# Altium project MB1165.PrjPCB (part 1 of 4)
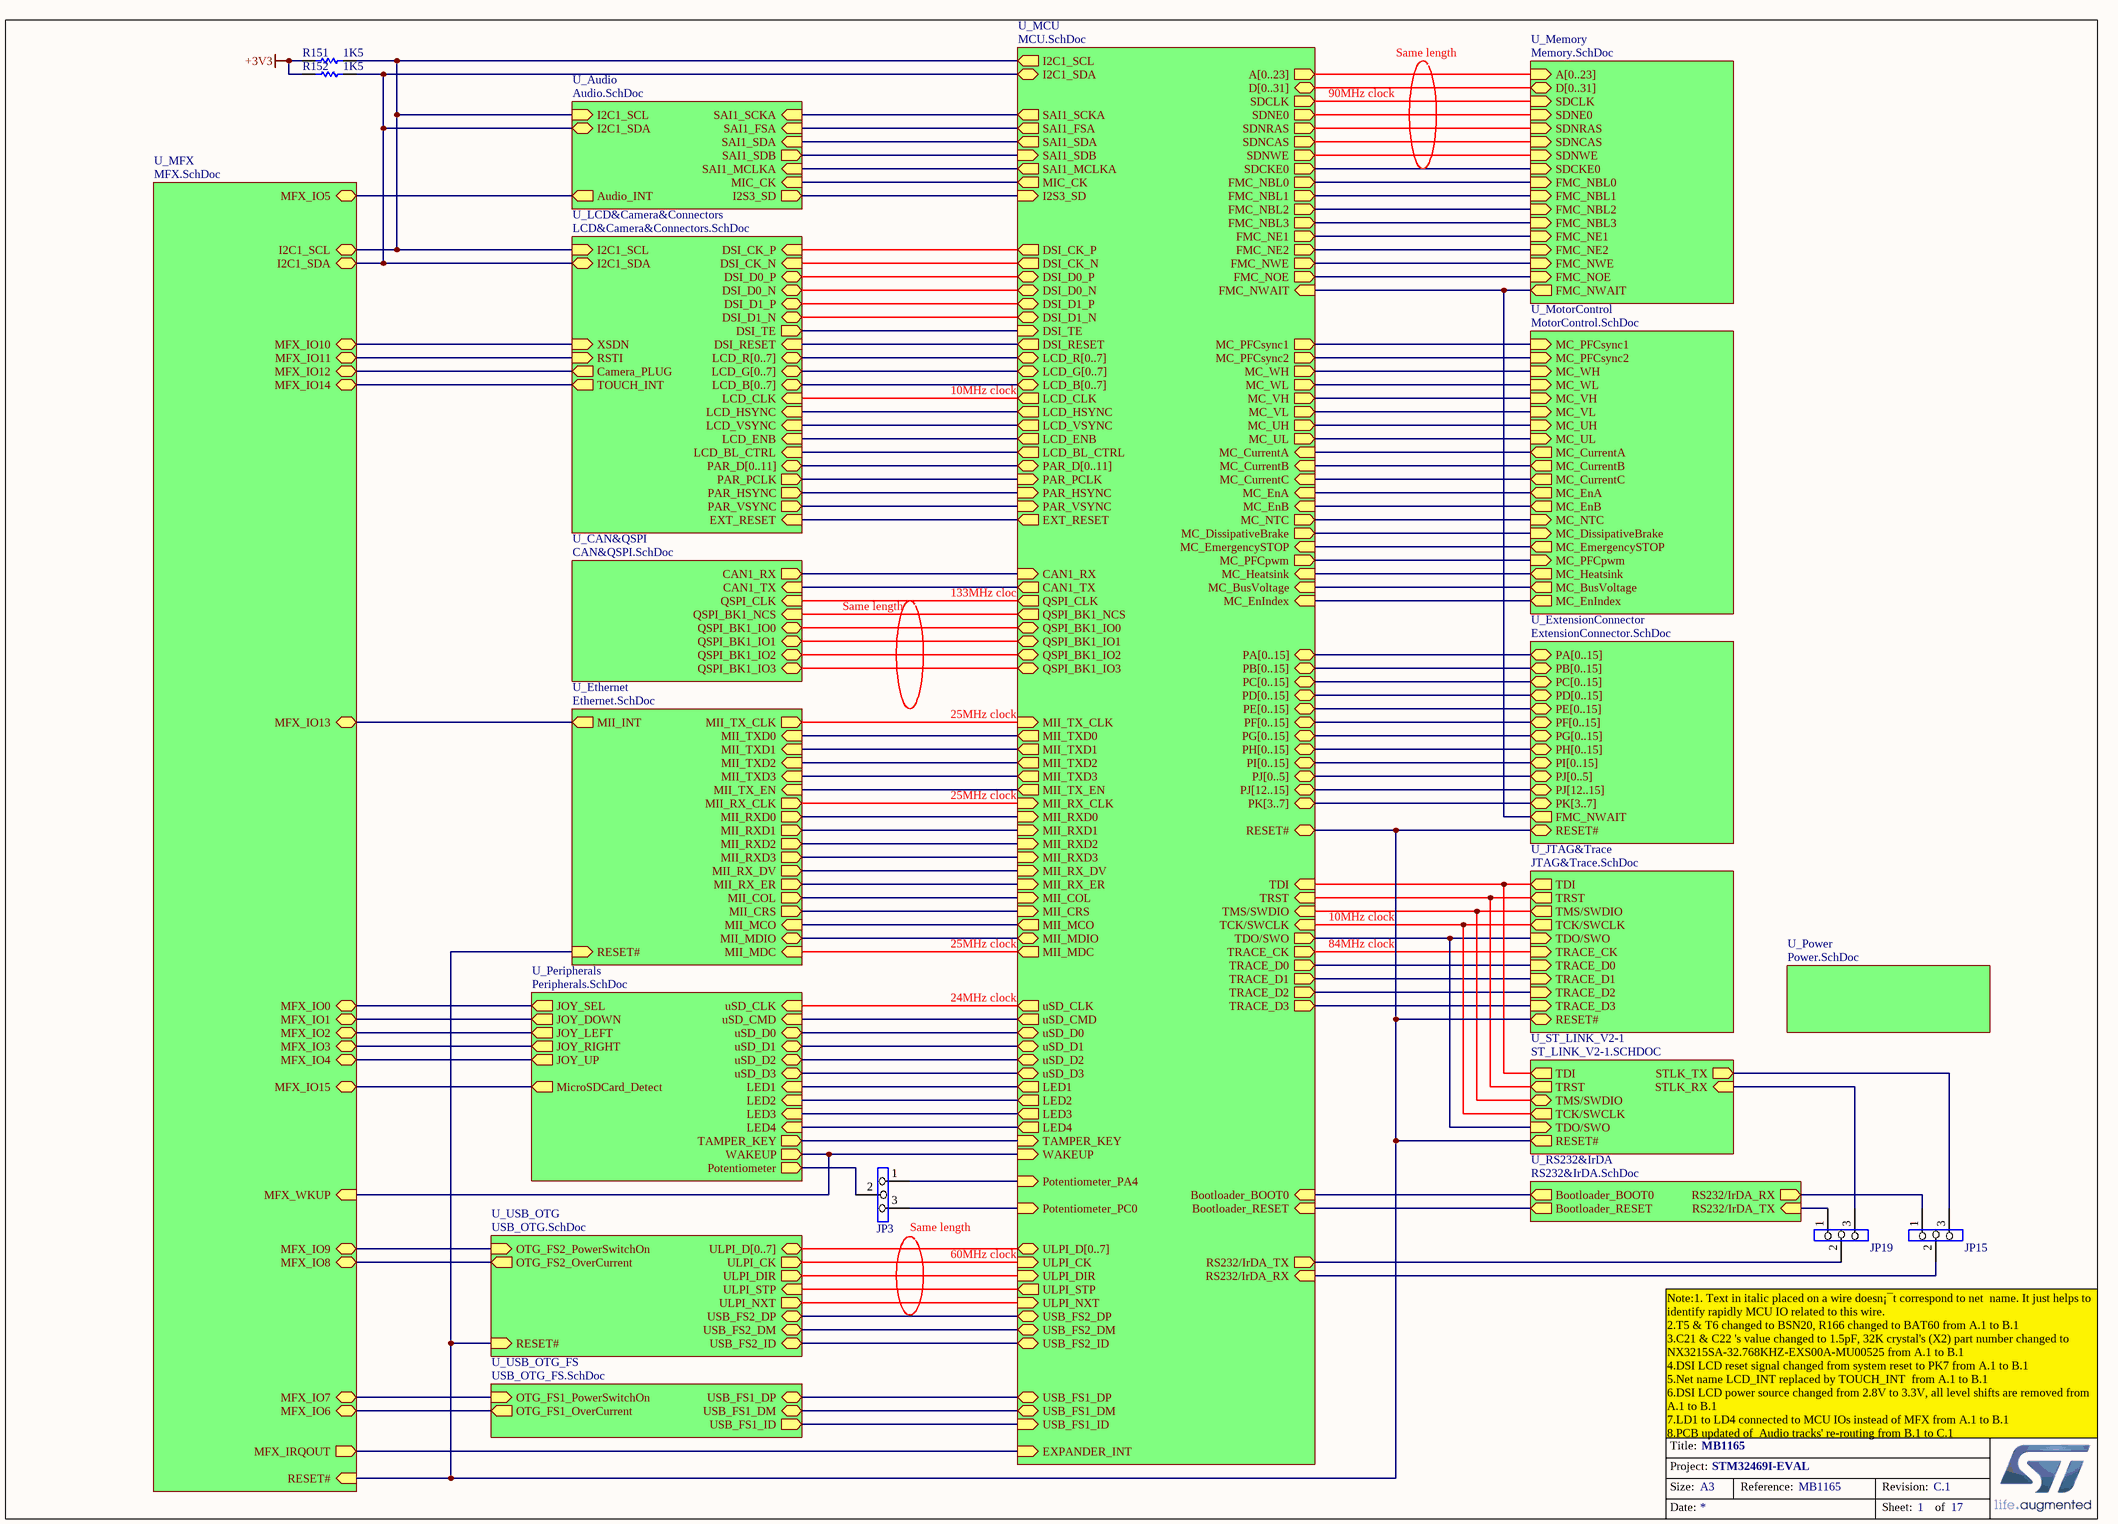
[diagram p0: MB1165.SchDoc]
17 sheets, 707 parts. Net scope: hierarchical (ports join the sheet entries above them; power ports are global).
Sheets:
  MB1165.SchDoc
    U_Audio = Audio.SchDoc
    U_CAN&QSPI = CAN&QSPI.SchDoc
    U_Ethernet = Ethernet.SchDoc
    U_ExtensionConnector = ExtensionConnector.SchDoc
    U_JTAG&Trace = JTAG&Trace.SchDoc
    U_Memory = Memory.SchDoc
    U_MotorControl = MotorControl.SchDoc
    U_Power = Power.SchDoc
    U_RS232&IrDA = RS232&IrDA.SchDoc
    U_ST_LINK_V2-1 = ST_LINK_V2-1.SCHDOC
    U_USB_OTG = USB_OTG.SchDoc
    U_USB_OTG_FS = USB_OTG_FS.SchDoc
    U_MFX = MFX.SchDoc
    U_MCU = MCU.SchDoc
    U_LCD&Camera&Connectors = LCD&Camera&Connectors.SchDoc
    U_Peripherals = Peripherals.SchDoc

## Sheet MB1165.SchDoc: MB1165
size A3; DocumentNumber: MB1165; Revision: C.1; SheetNumber: 1; SheetTotal: 17; Project: STM32469I-EVAL

### Parts
JP3  (no value)  [SIP3]
JP15  (no value)  [SIP3]
JP19  (no value)  [SIP3]
R151  1K5  [0603R]
R152  1K5  [0603R]

### Sub-sheets
U_Audio = Audio.SchDoc: SAI1_SCKA (in), SAI1_FSA (in), SAI1_SDA (in), SAI1_SDB (out), Audio_INT (out), I2C1_SDA (bidir), I2C1_SCL (in), SAI1_MCLKA (in), MIC_CK (in), I2S3_SD (out)
U_CAN&QSPI = CAN&QSPI.SchDoc: CAN1_TX (in), CAN1_RX (out), QSPI_BK1_IO0 (bidir), QSPI_BK1_IO3 (bidir), QSPI_BK1_IO2 (bidir), QSPI_BK1_IO1 (bidir), QSPI_CLK (in), QSPI_BK1_NCS (in)
U_Ethernet = Ethernet.SchDoc: MII_TXD0 (in), MII_TX_EN (in), MII_TX_CLK (out), MII_RXD0 (out), MII_RX_ER (out), MII_RX_DV (out), MII_RX_CLK (out), MII_COL (out), MII_CRS (out), MII_MDC (in), MII_MDIO (bidir), RESET# (in), MII_TXD1 (in), MII_TXD2 (in), MII_TXD3 (in), MII_RXD1 (out), MII_RXD2 (out), MII_RXD3 (out), MII_INT (out), MII_MCO (in)
U_ExtensionConnector = ExtensionConnector.SchDoc: PA[0..15] (bidir), PB[0..15] (bidir), PC[0..15] (bidir), PD[0..15] (bidir), PE[0..15] (bidir), PF[0..15] (bidir), PG[0..15] (bidir), PH[0..15] (bidir), PI[0..15] (bidir), RESET# (bidir), FMC_NWAIT (out), PJ[0..5] (bidir), PK[3..7] (bidir), PJ[12..15] (bidir)
U_JTAG&Trace = JTAG&Trace.SchDoc: TDI (out), RESET# (bidir), TRACE_D3 (in), TRACE_D2 (in), TRACE_D1 (in), TRACE_D0 (in), TRACE_CK (in), TRST (out), TMS/SWDIO (out), TCK/SWCLK (out), TDO/SWO (in)
U_LCD&Camera&Connectors = LCD&Camera&Connectors.SchDoc: LCD_R[0..7] (bidir), LCD_HSYNC (in), LCD_VSYNC (in), LCD_CLK (in), LCD_ENB (in), I2C1_SDA (bidir), I2C1_SCL (in), LCD_B[0..7] (bidir), LCD_G[0..7] (bidir), RSTI (in), XSDN (in), PAR_HSYNC (out), PAR_PCLK (out), PAR_VSYNC (out), PAR_D[0..11] (bidir), TOUCH_INT (out), Camera_PLUG (out), EXT_RESET (in), DSI_CK_P (in), DSI_CK_N (in), DSI_D0_P (bidir), DSI_D0_N (bidir), DSI_D1_P (bidir), DSI_D1_N (bidir), LCD_BL_CTRL (in), DSI_TE (out), DSI_RESET (in)
U_MCU = MCU.SchDoc: PA[0..15] (bidir), PB[0..15] (bidir), PC[0..15] (bidir), PD[0..15] (bidir), PE[0..15] (bidir), PF[0..15] (bidir), PG[0..15] (bidir), PH[0..15] (bidir), PI[0..15] (bidir), MC_EnA (in), MII_RX_CLK (in), MC_EnB (in), MII_MDIO (bidir), MC_EnIndex (in), ULPI_CK (in), MC_EmergencySTOP (in), MII_RX_DV (in), MC_UL (out), LCD_BL_CTRL (out), MC_PFCsync1 (out), RS232/IrDA_TX (out), RS232/IrDA_RX (in), USB_FS1_ID (in), CAN1_RX (in), USB_FS1_DM (bidir), MC_PFCpwm (out), CAN1_TX (out), USB_FS1_DP (bidir), MC_PFCsync2 (out), TMS/SWDIO (in), TCK/SWCLK (in), TDI (in), MC_VL (out), MC_WL (out), TDO/SWO (out), MIC_CK (out), TRST (in), I2C1_SCL (out), MII_TXD3 (out), MC_DissipativeBrake (out), I2C1_SDA (bidir), USB_FS2_ID (bidir), USB_FS2_DM (bidir), USB_FS2_DP (bidir), ULPI_STP (out), MII_MDC (out), MC_CurrentA (in), MII_TXD2 (out), MC_CurrentB (in), MII_TX_CLK (in), MC_CurrentC (in), MII_RXD0 (in), MC_BusVoltage (in), MII_RXD1 (in), MC_Heatsink (in), MC_UH (out), MC_VH (out), uSD_D0 (bidir), MC_WH (out), uSD_D1 (bidir), uSD_D2 (bidir), EXT_RESET (out), uSD_D3 (bidir), uSD_CLK (out), TAMPER_KEY (in), MII_CRS (in), LCD_ENB (out), uSD_CMD (out), FMC_NOE (out), FMC_NWE (out), FMC_NWAIT (in), I2S3_SD (in), FMC_NE1 (out), FMC_NBL3 (out), FMC_NBL2 (out), EXPANDER_INT (in), MII_RX_ER (in), ULPI_DIR (in), LCD_HSYNC (out), LCD_VSYNC (out), LCD_CLK (out), FMC_NBL0 (out), FMC_NBL1 (out), TRACE_CK (out), TRACE_D0 (out), TRACE_D2 (out), TRACE_D1 (out), SAI1_SDA (out), TRACE_D3 (out), SAI1_SDB (in), SAI1_SCKA (out), SAI1_FSA (out), SAI1_MCLKA (out), SDNRAS (out), SDCLK (out), FMC_NE2 (out), MII_TX_EN (out), MC_NTC (out), MII_TXD1 (out), SDNCAS (out), SDCKE0 (out), SDNE0 (out), MII_COL (in), ULPI_NXT (in), SDNWE (out), MII_RXD2 (in), MII_RXD3 (in), LCD_G[0..7] (bidir), LCD_B[0..7] (bidir), D[0..31] (bidir), A[0..23] (out), ULPI_D[0..7] (bidir), RESET# (bidir), PJ[0..5] (bidir), PK[3..7] (bidir), PAR_VSYNC (in), PAR_D[0..11] (bidir), PAR_PCLK (in), PAR_HSYNC (in), MII_MCO (out), LCD_R[0..7] (bidir), Bootloader_BOOT0 (in), QSPI_CLK (out), QSPI_BK1_NCS (out), QSPI_BK1_IO3 (bidir), QSPI_BK1_IO2 (bidir), QSPI_BK1_IO1 (bidir), QSPI_BK1_IO0 (bidir), Bootloader_RESET (in), WAKEUP (in), Potentiometer_PA4 (in), MII_TXD0 (out), Potentiometer_PC0 (in), DSI_TE (in), DSI_CK_P (out), DSI_CK_N (out), DSI_D0_P (bidir), DSI_D0_N (bidir), DSI_D1_P (bidir), DSI_D1_N (bidir), PJ[12..15] (bidir), DSI_RESET (out), LED1 (out), LED2 (out), LED3 (out), LED4 (out)
U_Memory = Memory.SchDoc: FMC_NE1 (in), FMC_NWE (in), FMC_NOE (in), FMC_NWAIT (out), FMC_NBL0 (in), FMC_NBL1 (in), D[0..31] (bidir), A[0..23] (in), SDNCAS (in), SDNWE (in), SDNRAS (in), SDNE0 (in), SDCKE0 (in), SDCLK (in), FMC_NBL3 (in), FMC_NBL2 (in), FMC_NE2 (in)
U_MFX = MFX.SchDoc: MFX_IRQOUT (out), I2C1_SDA (bidir), I2C1_SCL (bidir), MFX_IO5 (bidir), MFX_IO6 (bidir), MFX_IO7 (bidir), MFX_IO8 (bidir), MFX_IO9 (bidir), MFX_IO10 (bidir), MFX_IO11 (bidir), MFX_IO12 (bidir), MFX_IO13 (bidir), MFX_IO14 (bidir), MFX_IO15 (bidir), MFX_WKUP (in), MFX_IO0 (bidir), MFX_IO1 (bidir), MFX_IO2 (bidir), MFX_IO3 (bidir), MFX_IO4 (bidir), RESET# (in)
U_MotorControl = MotorControl.SchDoc: MC_EmergencySTOP (out), MC_CurrentA (out), MC_CurrentB (out), MC_CurrentC (out), MC_PFCsync1 (in), MC_PFCsync2 (in), MC_WL (in), MC_VH (in), MC_VL (in), MC_UH (in), MC_UL (in), MC_WH (in), MC_NTC (in), MC_DissipativeBrake (in), MC_PFCpwm (in), MC_EnA (out), MC_EnB (out), MC_Heatsink (out), MC_BusVoltage (out), MC_EnIndex (out)
U_Peripherals = Peripherals.SchDoc: JOY_SEL (out), JOY_DOWN (out), JOY_LEFT (out), JOY_RIGHT (out), JOY_UP (out), uSD_CLK (in), uSD_CMD (in), uSD_D0 (bidir), uSD_D1 (bidir), uSD_D2 (bidir), uSD_D3 (bidir), MicroSDCard_Detect (out), TAMPER_KEY (out), WAKEUP (out), Potentiometer (out), LED4 (in), LED3 (in), LED1 (in), LED2 (in)
U_Power = Power.SchDoc: no entries
U_RS232&IrDA = RS232&IrDA.SchDoc: RS232/IrDA_TX (in), RS232/IrDA_RX (out), Bootloader_BOOT0 (out), Bootloader_RESET (out)
U_ST_LINK_V2-1 = ST_LINK_V2-1.SCHDOC: STLK_RX (in), STLK_TX (out), TDI (out), TRST (out), TMS/SWDIO (bidir), TCK/SWCLK (out), TDO/SWO (in), RESET# (out)
U_USB_OTG = USB_OTG.SchDoc: ULPI_D[0..7] (bidir), ULPI_CK (out), ULPI_DIR (out), ULPI_NXT (out), ULPI_STP (in), RESET# (in), USB_FS2_DM (bidir), USB_FS2_DP (bidir), OTG_FS2_PowerSwitchOn (in), OTG_FS2_OverCurrent (out), USB_FS2_ID (bidir)
U_USB_OTG_FS = USB_OTG_FS.SchDoc: OTG_FS1_PowerSwitchOn (in), OTG_FS1_OverCurrent (out), USB_FS1_DM (bidir), USB_FS1_DP (bidir), USB_FS1_ID (out)

### Nets
+3V3: R151.1 R152.1
I2C1_SCL: R151.2 ; sheet U_Audio/I2C1_SCL, sheet U_MFX/I2C1_SCL, sheet U_MCU/I2C1_SCL, sheet U_LCD&Camera&Connectors/I2C1_SCL
I2C1_SDA: R152.2 ; sheet U_Audio/I2C1_SDA, sheet U_MFX/I2C1_SDA, sheet U_MCU/I2C1_SDA, sheet U_LCD&Camera&Connectors/I2C1_SDA
LCD_B4: sheet U_MCU/LED1, sheet U_Peripherals/LED1
LCD_B5: sheet U_MCU/LED2, sheet U_Peripherals/LED2
LCD_B6: sheet U_MCU/LED3, sheet U_Peripherals/LED3
LCD_B7: sheet U_MCU/LED4, sheet U_Peripherals/LED4
LCD_BL_CTRL: sheet U_MCU/LCD_BL_CTRL, sheet U_LCD&Camera&Connectors/LCD_BL_CTRL
LCD_R3: sheet U_MCU/DSI_TE, sheet U_LCD&Camera&Connectors/DSI_TE
MII_TXD0: sheet U_Ethernet/MII_TXD0, sheet U_MCU/MII_TXD0
PA4: JP3.1 ; sheet U_MCU/Potentiometer_PA4
PA5: sheet U_USB_OTG/ULPI_CK, sheet U_MCU/ULPI_CK
PA6: sheet U_MotorControl/MC_EmergencySTOP, sheet U_MCU/MC_EmergencySTOP, sheet U_MCU/PAR_PCLK, sheet U_LCD&Camera&Connectors/PAR_PCLK
PA10: JP15.2 ; sheet U_USB_OTG_FS/USB_FS1_ID, sheet U_MCU/RS232/IrDA_RX, sheet U_MCU/USB_FS1_ID
PA11: sheet U_USB_OTG_FS/USB_FS1_DM, sheet U_MCU/USB_FS1_DM
PA13: sheet U_JTAG&Trace/TMS/SWDIO, sheet U_ST_LINK_V2-1/TMS/SWDIO, sheet U_MCU/TMS/SWDIO
PA14: sheet U_JTAG&Trace/TCK/SWCLK, sheet U_ST_LINK_V2-1/TCK/SWCLK, sheet U_MCU/TCK/SWCLK
PA15: sheet U_JTAG&Trace/TDI, sheet U_ST_LINK_V2-1/TDI, sheet U_MCU/TDI
PAR_D1: sheet U_MotorControl/MC_VH, sheet U_MCU/MC_VH
PAR_D8: sheet U_MCU/EXT_RESET, sheet U_LCD&Camera&Connectors/EXT_RESET
PAR_D9: sheet U_MCU/uSD_CLK, sheet U_Peripherals/uSD_CLK
PB4: sheet U_JTAG&Trace/TRST, sheet U_ST_LINK_V2-1/TRST, sheet U_MCU/TRST
PB6: sheet U_CAN&QSPI/QSPI_BK1_NCS, sheet U_MCU/QSPI_BK1_NCS
PB7: sheet U_MCU/PAR_VSYNC, sheet U_LCD&Camera&Connectors/PAR_VSYNC
PC0: JP3.3 ; sheet U_MCU/Potentiometer_PC0
PC13: sheet U_MCU/TAMPER_KEY, sheet U_Peripherals/TAMPER_KEY
PD4: sheet U_Memory/FMC_NOE, sheet U_MCU/FMC_NOE
PD5: sheet U_Memory/FMC_NWE, sheet U_MCU/FMC_NWE
PD7: sheet U_Memory/FMC_NE1, sheet U_MCU/FMC_NE1
PE0: sheet U_Memory/FMC_NBL0, sheet U_MCU/FMC_NBL0
PE1: sheet U_Memory/FMC_NBL1, sheet U_MCU/FMC_NBL1
PF6: sheet U_CAN&QSPI/QSPI_BK1_IO3, sheet U_MCU/QSPI_BK1_IO3
PF7: sheet U_CAN&QSPI/QSPI_BK1_IO2, sheet U_MCU/QSPI_BK1_IO2
PF8: sheet U_CAN&QSPI/QSPI_BK1_IO0, sheet U_MCU/QSPI_BK1_IO0
PF9: sheet U_CAN&QSPI/QSPI_BK1_IO1, sheet U_MCU/QSPI_BK1_IO1
PF10: sheet U_CAN&QSPI/QSPI_CLK, sheet U_MCU/QSPI_CLK
PF11: sheet U_Memory/SDNRAS, sheet U_MCU/SDNRAS
PG7: sheet U_Audio/SAI1_MCLKA, sheet U_MCU/SAI1_MCLKA
PG8: sheet U_Memory/SDCLK, sheet U_MCU/SDCLK
PG9: sheet U_Memory/FMC_NE2, sheet U_MCU/FMC_NE2
PG15: sheet U_Memory/SDNCAS, sheet U_MCU/SDNCAS
PH2: sheet U_Memory/SDCKE0, sheet U_MCU/SDCKE0
PH3: sheet U_Memory/SDNE0, sheet U_MCU/SDNE0
PH5: sheet U_Memory/SDNWE, sheet U_MCU/SDNWE
PH7: sheet U_Ethernet/MII_RXD3, sheet U_MCU/MII_RXD3
PI4: sheet U_Memory/FMC_NBL2, sheet U_MCU/FMC_NBL2
PI5: sheet U_Memory/FMC_NBL3, sheet U_MCU/FMC_NBL3
PI8: sheet U_MFX/MFX_IRQOUT, sheet U_MCU/EXPANDER_INT
PI12: sheet U_MCU/LCD_HSYNC, sheet U_LCD&Camera&Connectors/LCD_HSYNC
PI13: sheet U_MCU/LCD_VSYNC, sheet U_LCD&Camera&Connectors/LCD_VSYNC
PI14: sheet U_MCU/LCD_CLK, sheet U_LCD&Camera&Connectors/LCD_CLK
PK7: sheet U_MCU/LCD_ENB, sheet U_MCU/DSI_RESET, sheet U_LCD&Camera&Connectors/LCD_ENB, sheet U_LCD&Camera&Connectors/DSI_RESET
RESET#: sheet U_Ethernet/RESET#, sheet U_ExtensionConnector/RESET#, sheet U_JTAG&Trace/RESET#, sheet U_ST_LINK_V2-1/RESET#, sheet U_USB_OTG/RESET#, sheet U_MFX/RESET#, sheet U_MCU/RESET#
STLINK_RX: JP19.3 ; sheet U_ST_LINK_V2-1/STLK_RX
STLINK_TX: JP15.3 ; sheet U_ST_LINK_V2-1/STLK_TX
T_JTDO: sheet U_JTAG&Trace/TDO/SWO, sheet U_ST_LINK_V2-1/TDO/SWO, sheet U_MCU/TDO/SWO
TOUCH_INT: sheet U_MFX/MFX_IO14, sheet U_LCD&Camera&Connectors/TOUCH_INT
NetB4_1: sheet U_MFX/MFX_IO2, sheet U_Peripherals/JOY_LEFT
NetB4_2: sheet U_MFX/MFX_IO0, sheet U_Peripherals/JOY_SEL
NetB4_3: sheet U_MFX/MFX_IO1, sheet U_Peripherals/JOY_DOWN
NetB4_4: sheet U_MFX/MFX_IO3, sheet U_Peripherals/JOY_RIGHT
NetB4_6: sheet U_MFX/MFX_IO4, sheet U_Peripherals/JOY_UP
NetC6_2: sheet U_MotorControl/MC_EnA, sheet U_MCU/MC_EnA
NetC7_2: sheet U_MotorControl/MC_PFCsync2, sheet U_MCU/MC_PFCsync2
NetC8_2: sheet U_MotorControl/MC_EnB, sheet U_MCU/MC_EnB
NetC9_2: sheet U_MotorControl/MC_EnIndex, sheet U_MCU/MC_EnIndex
NetC10_2: sheet U_MotorControl/MC_PFCpwm, sheet U_MCU/MC_PFCpwm
NetC11_1: sheet U_MotorControl/MC_Heatsink, sheet U_MCU/MC_Heatsink
NetC12_2: sheet U_MotorControl/MC_CurrentC, sheet U_MCU/MC_CurrentC
NetC13_2: sheet U_MotorControl/MC_CurrentB, sheet U_MCU/MC_CurrentB
NetC14_2: sheet U_MotorControl/MC_CurrentA, sheet U_MCU/MC_CurrentA
NetC15_1: sheet U_MotorControl/MC_BusVoltage, sheet U_MCU/MC_BusVoltage
NetC18_2: sheet U_MotorControl/MC_PFCsync1, sheet U_MCU/MC_PFCsync1
NetCN1_3: sheet U_MotorControl/MC_UH, sheet U_MCU/MC_UH
NetCN1_5: sheet U_MotorControl/MC_UL, sheet U_MCU/MC_UL
NetCN1_9: sheet U_MotorControl/MC_VL, sheet U_MCU/MC_VL
NetCN1_11: sheet U_MotorControl/MC_WH, sheet U_MCU/MC_WH
NetCN1_13: sheet U_MotorControl/MC_WL, sheet U_MCU/MC_WL
NetCN1_21: sheet U_MotorControl/MC_NTC, sheet U_MCU/MC_NTC
NetCN1_23: sheet U_MotorControl/MC_DissipativeBrake, sheet U_MCU/MC_DissipativeBrake
NetCN4_15: sheet U_MFX/MFX_IO12, sheet U_LCD&Camera&Connectors/Camera_PLUG
NetCN4_17: sheet U_MFX/MFX_IO11, sheet U_LCD&Camera&Connectors/RSTI
NetCN4_19: sheet U_MFX/MFX_IO10, sheet U_LCD&Camera&Connectors/XSDN
NetCN4_31: sheet U_MCU/PAR_HSYNC, sheet U_LCD&Camera&Connectors/PAR_HSYNC
NetCN11_6: sheet U_ExtensionConnector/FMC_NWAIT, sheet U_Memory/FMC_NWAIT, sheet U_MCU/FMC_NWAIT
NetCN12_12: sheet U_JTAG&Trace/TRACE_CK, sheet U_MCU/TRACE_CK
NetCN12_14: sheet U_JTAG&Trace/TRACE_D0, sheet U_MCU/TRACE_D0
NetCN12_16: sheet U_JTAG&Trace/TRACE_D1, sheet U_MCU/TRACE_D1
NetCN12_18: sheet U_JTAG&Trace/TRACE_D2, sheet U_MCU/TRACE_D2
NetCN12_20: sheet U_JTAG&Trace/TRACE_D3, sheet U_MCU/TRACE_D3
NetCN14_4: sheet U_USB_OTG/USB_FS2_ID, sheet U_MCU/USB_FS2_ID
NetCN15_3: sheet U_MCU/DSI_CK_P, sheet U_LCD&Camera&Connectors/DSI_CK_P
NetCN15_5: sheet U_MCU/DSI_CK_N, sheet U_LCD&Camera&Connectors/DSI_CK_N
NetCN15_9: sheet U_MCU/DSI_D0_P, sheet U_LCD&Camera&Connectors/DSI_D0_P
NetCN15_11: sheet U_MCU/DSI_D0_N, sheet U_LCD&Camera&Connectors/DSI_D0_N
NetCN15_15: sheet U_MCU/DSI_D1_P, sheet U_LCD&Camera&Connectors/DSI_D1_P
NetCN15_17: sheet U_MCU/DSI_D1_N, sheet U_LCD&Camera&Connectors/DSI_D1_N
NetCN17_1: sheet U_MCU/uSD_D2, sheet U_Peripherals/uSD_D2
NetCN17_2: sheet U_MCU/uSD_D3, sheet U_Peripherals/uSD_D3
NetCN17_3: sheet U_MCU/uSD_CMD, sheet U_Peripherals/uSD_CMD
NetCN17_7: sheet U_MCU/uSD_D0, sheet U_Peripherals/uSD_D0
NetCN17_8: sheet U_MCU/uSD_D1, sheet U_Peripherals/uSD_D1
NetD1_1: sheet U_RS232&IrDA/Bootloader_BOOT0, sheet U_MCU/Bootloader_BOOT0
NetD5_C3: sheet U_USB_OTG_FS/USB_FS1_DP, sheet U_MCU/USB_FS1_DP
NetD6_C3: sheet U_USB_OTG/USB_FS2_DP, sheet U_MCU/USB_FS2_DP
NetD6_D3: sheet U_USB_OTG/USB_FS2_DM, sheet U_MCU/USB_FS2_DM
NetJP3_2: JP3.2 ; sheet U_Peripherals/Potentiometer
NetJP4_2: sheet U_RS232&IrDA/Bootloader_RESET, sheet U_MCU/Bootloader_RESET
NetJP6_3: sheet U_Audio/I2S3_SD, sheet U_MCU/I2S3_SD
NetJP7_3: sheet U_Ethernet/MII_MCO, sheet U_MCU/MII_MCO
NetJP8_2: JP15.1 ; sheet U_RS232&IrDA/RS232/IrDA_RX
NetJP9_2: sheet U_CAN&QSPI/CAN1_RX, sheet U_MCU/CAN1_RX
NetJP18_3: sheet U_Audio/MIC_CK, sheet U_MCU/MIC_CK
NetJP19_1: JP19.1 ; sheet U_RS232&IrDA/RS232/IrDA_TX
NetJP19_2: JP19.2 ; sheet U_MCU/RS232/IrDA_TX
NetR43_2: sheet U_Ethernet/MII_RXD2, sheet U_MCU/MII_RXD2
NetR44_2: sheet U_Ethernet/MII_RXD1, sheet U_MCU/MII_RXD1
NetR45_2: sheet U_Ethernet/MII_RXD0, sheet U_MCU/MII_RXD0
NetR46_2: sheet U_Ethernet/MII_RX_DV, sheet U_MCU/MII_RX_DV
NetR47_2: sheet U_Ethernet/MII_RX_CLK, sheet U_MCU/MII_RX_CLK
NetR57_2: sheet U_Ethernet/MII_TX_CLK, sheet U_MCU/MII_TX_CLK
NetR68_2: sheet U_Ethernet/MII_INT, sheet U_MFX/MFX_IO13
NetR69_1: sheet U_Ethernet/MII_MDIO, sheet U_MCU/MII_MDIO
NetR111_1: sheet U_USB_OTG/OTG_FS2_OverCurrent, sheet U_MFX/MFX_IO8
NetR117_2: sheet U_USB_OTG_FS/OTG_FS1_PowerSwitchOn, sheet U_MFX/MFX_IO7
NetR119_1: sheet U_USB_OTG_FS/OTG_FS1_OverCurrent, sheet U_MFX/MFX_IO6
NetR142_1: sheet U_MFX/MFX_IO15, sheet U_Peripherals/MicroSDCard_Detect
NetR163_2: sheet U_MFX/MFX_WKUP, sheet U_MCU/WAKEUP, sheet U_Peripherals/WAKEUP
NetR233_2: sheet U_Ethernet/MII_TXD2, sheet U_MCU/MII_TXD2
NetR235_2: sheet U_Ethernet/MII_TXD1, sheet U_MCU/MII_TXD1
NetR238_1: sheet U_Ethernet/MII_TXD3, sheet U_MCU/MII_TXD3
NetR242_2: sheet U_Ethernet/MII_TX_EN, sheet U_MCU/MII_TX_EN
NetSB5_1: sheet U_Audio/SAI1_SCKA, sheet U_MCU/SAI1_SCKA
NetSB7_1: sheet U_Audio/SAI1_FSA, sheet U_MCU/SAI1_FSA
NetSB9_1: sheet U_Audio/SAI1_SDB, sheet U_MCU/SAI1_SDB
NetSB12_2: sheet U_Ethernet/MII_RX_ER, sheet U_MCU/MII_RX_ER
NetSB15_1: sheet U_USB_OTG/OTG_FS2_PowerSwitchOn, sheet U_MFX/MFX_IO9
NetSB19_1: sheet U_Audio/SAI1_SDA, sheet U_MCU/SAI1_SDA
NetSB31_2: sheet U_Ethernet/MII_MDC, sheet U_MCU/MII_MDC
NetSB32_2: sheet U_USB_OTG/ULPI_DIR, sheet U_MCU/ULPI_DIR
NetSB34_2: sheet U_USB_OTG/ULPI_STP, sheet U_MCU/ULPI_STP
NetSB48_1: sheet U_Ethernet/MII_CRS, sheet U_MCU/MII_CRS
NetSB56_2: sheet U_USB_OTG/ULPI_NXT, sheet U_MCU/ULPI_NXT
NetSB63_2: sheet U_Ethernet/MII_COL, sheet U_MCU/MII_COL
NetSB67_1: sheet U_CAN&QSPI/CAN1_TX, sheet U_MCU/CAN1_TX
NetU22_15: sheet U_Audio/Audio_INT, sheet U_MFX/MFX_IO5

### Buses and harness runs
bus sheet U_ExtensionConnector/PA[0..15] = sheet U_MCU/PA[0..15]
bus sheet U_ExtensionConnector/PB[0..15] = sheet U_MCU/PB[0..15]
bus sheet U_ExtensionConnector/PC[0..15] = sheet U_MCU/PC[0..15]
bus sheet U_ExtensionConnector/PD[0..15] = sheet U_MCU/PD[0..15]
bus sheet U_ExtensionConnector/PE[0..15] = sheet U_MCU/PE[0..15]
bus sheet U_ExtensionConnector/PF[0..15] = sheet U_MCU/PF[0..15]
bus sheet U_ExtensionConnector/PG[0..15] = sheet U_MCU/PG[0..15]
bus sheet U_ExtensionConnector/PH[0..15] = sheet U_MCU/PH[0..15]
bus sheet U_ExtensionConnector/PI[0..15] = sheet U_MCU/PI[0..15]
bus sheet U_ExtensionConnector/PJ[0..5] = sheet U_MCU/PJ[0..5]
bus sheet U_ExtensionConnector/PJ[12..15] = sheet U_MCU/PJ[12..15]
bus sheet U_ExtensionConnector/PK[3..7] = sheet U_MCU/PK[3..7]
bus sheet U_LCD&Camera&Connectors/LCD_B[0..7] = sheet U_MCU/LCD_B[0..7]
bus sheet U_LCD&Camera&Connectors/LCD_G[0..7] = sheet U_MCU/LCD_G[0..7]
bus sheet U_LCD&Camera&Connectors/LCD_R[0..7] = sheet U_MCU/LCD_R[0..7]
bus sheet U_LCD&Camera&Connectors/PAR_D[0..11] = sheet U_MCU/PAR_D[0..11]
bus sheet U_MCU/A[0..23] = sheet U_Memory/A[0..23]
bus sheet U_MCU/D[0..31] = sheet U_Memory/D[0..31]
bus sheet U_MCU/ULPI_D[0..7] = sheet U_USB_OTG/ULPI_D[0..7]

### Notes on the sheet
- Same length
- 90MHz clock
- 10MHz clock
- 133MHz clock
- 25MHz clock
- 24MHz clock
- 84MHz clock
- (near JP3) Same length
- 60MHz clock
- Note:1. Text in italic placed on a wire doesn¡¯t correspond to net  name. It just helps to identify rapidly MCU IO related to this wire.
  2.T5 & T6 changed to BSN20, R166 changed to BAT60 from A.1 to B.1
  3.C21 & C22 's value changed to 1.5pF, 32K crystal's (X2) part number changed to NX3215SA-32.768KHZ-EXS00A-MU00525 from A.1 to B.1
  4.DSI LCD reset signal changed from system reset to PK7 from A.1 to B.1
  5.Net name LCD_INT replaced by TOUCH_INT  from A.1 to B.1
  6.DSI LCD power source changed from 2.8V to 3.3V, all level shifts are removed from A.1 to B.1
  7.LD1 to LD4 connected to MCU IOs instead of MFX from A.1 to B.1
  8.PCB updated of  Audio tracks' re-routing from B.1 to C.1
- Title:
- Project:
- Size:
- Date:
- A3
- Reference:
- Sheet:
- Revision:
- of

### Library data of the parts
JP3 JP15 JP19 = Jumper3
R151 R152 = Res1: Resistor; Value: 1K; Published: 8-Jun-2000; Revision: July-2002: Re-released for DXP Platform.; Publisher: Altium Limited

## Sheet Audio.SchDoc: Audio
size A4; DocumentNumber: MB1165; Revision: C.1; SheetNumber: 5; SheetTotal: 17; Project: STM32469I-EVAL
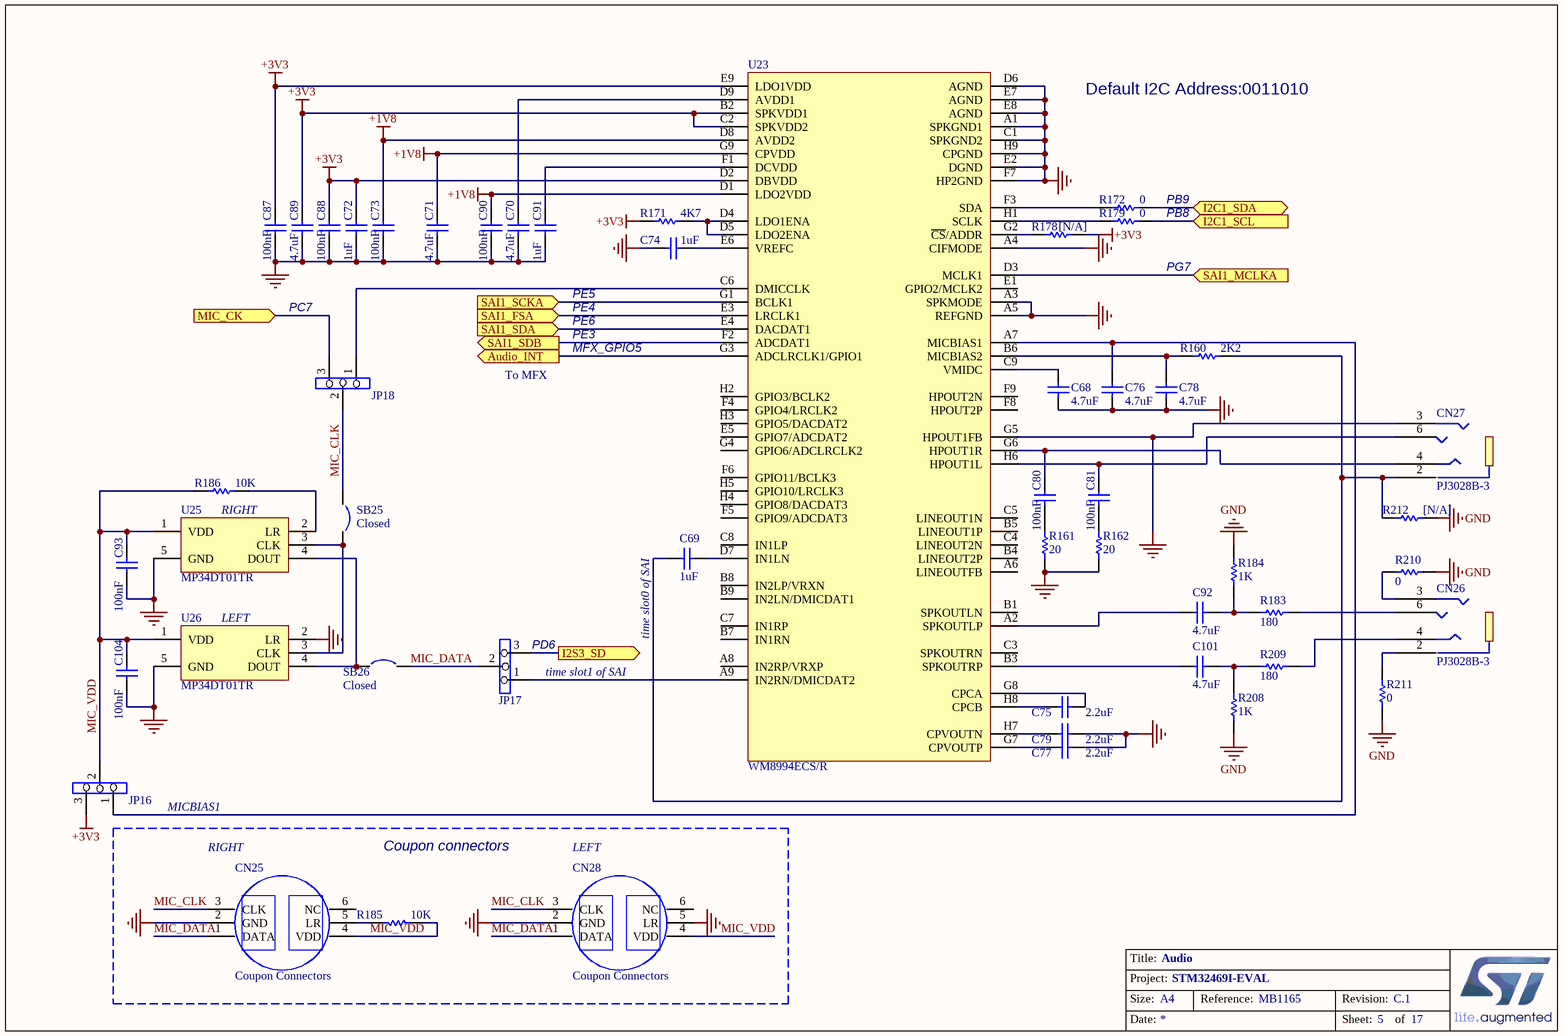
[diagram p1: Audio.SchDoc]

### Parts
C68  4.7uF  [0603C]
C69  1uF  [0603C]
C70  4.7uF  [0603C]
C71  4.7uF  [0603C]
C72  1uF  [0603C]
C73  100nF  [0603C]
C74  1uF  [0603C]
C75  2.2uF  [0603C]
C76  4.7uF  [0603C]
C77  2.2uF  [0603C]
C78  4.7uF  [0603C]
C79  2.2uF  [0603C]
C80  100nF  [0603C]
C81  100nF  [0603C]
C87  100nF  [0603C]
C88  100nF  [0603C]
C89  4.7uF  [0603C]
C90  100nF  [0603C]
C91  1uF  [0603C]
C92  4.7uF  [0603C]
C93  100nF  [0603C]
C101  4.7uF  [0603C]
C104  100nF  [0603C]
CN25  Coupon Connectors  [Coupon]
CN26  PJ3028B-3  [PJ3028B]
CN27  PJ3028B-3  [PJ3028B]
CN28  Coupon Connectors  [Coupon]
JP16  (no value)  [SIP3]
JP17  (no value)  [SIP3]
JP18  (no value)  [SIP3]
R160  2K2  [0603R]
R161  20  [0603R]
R162  20  [0603R]
R171  4K7  [0603R]
R172  0  [0603R]
R178  [N/A]  [0603R]
R179  0  [0603R]
R183  180  [0402R]
R184  1K  [0402R]
R185  10K  [0603R]
R186  10K  [0603R]
R208  1K  [0402R]
R209  180  [0402R]
R210  0  [0603R]
R211  0  [0603R]
R212  [N/A]  [0603R]
SB25  Closed  [SB_0603]
SB26  Closed  [SB_0603]
U23  WM8994ECS/R  [BGA72_0R5_4R5X4]
U25  MP34DT01TR  [MP34DT01TR]
U26  MP34DT01TR  [MP34DT01TR]

### Blocks framed on the sheet
Coupon connectors: CN25 CN28 R185

### Ports
Audio_INT (out), I2C1_SCL (in), I2C1_SDA (bidir), I2S3_SD (out), MIC_CK (in), SAI1_FSA (in), SAI1_MCLKA (in), SAI1_SCKA (in), SAI1_SDA (in), SAI1_SDB (out)

### Nets
+1V8: C71.1 C73.1 C90.1 U23.D1(LDO2VDD) U23.D8(AVDD2) U23.G9(CPVDD)
+3V3: C72.1 C87.1 C88.1 C89.1 JP16.3 R171.2 R178.1 U23.B2(SPKVDD1) U23.C2(SPKVDD2) U23.D2(DBVDD) U23.E9(LDO1VDD)
GND: C68.1 C70.2 C71.2 C72.2 C73.2 C74.2 C76.1 C77.2 C78.1 C79.2 C87.2 C88.2 C89.2 C90.2 C91.2 C93.2 C104.2 CN25.2(GND) CN27.3 CN28.2(GND) CN28.5(LR) R161.2 R162.2 R184.2 R208.1 R210.2 R211.2 R212.1 U23.A1(SPKGND1) U23.A3(SPKMODE) U23.A4(CIFMODE) U23.A5(REFGND) U23.C1(SPKGND2) U23.D6(AGND) U23.E2(DGND) U23.E7(AGND) U23.E8(AGND) U23.F7(HP2GND) U23.G5(HPOUT1FB) U23.H9(CPGND) U25.5(GND) U26.2(LR) U26.5(GND)
I2C1_SCL: R179.1 ; port I2C1_SCL
I2C1_SDA: R172.1 ; port I2C1_SDA
MIC_CLK: CN25.3(CLK) CN28.3(CLK) JP18.2 SB25.1
MIC_DATA: CN25.1(DATA) CN28.1(DATA) JP17.2 SB26.2
MIC_VDD: C93.1 C104.1 CN25.4(VDD) CN28.4(VDD) JP16.2 R185.2 R186.2 U25.1(VDD) U26.1(VDD)
PG7: U23.D3(MCLK1) ; port SAI1_MCLKA
NetC68_2: C68.2 U23.C9(VMIDC)
NetC69_1: C69.1 U23.D7(IN1LN)
NetC69_2: C69.2 CN27.2 R160.1 R212.2
NetC70_1: C70.1 U23.D9(AVDD1)
NetC74_1: C74.1 U23.E6(VREFC)
NetC75_1: C75.1 U23.H8(CPCB)
NetC75_2: C75.2 U23.G8(CPCA)
NetC76_2: C76.2 JP16.1 U23.A7(MICBIAS1)
NetC77_1: C77.1 U23.G7(CPVOUTP)
NetC78_2: C78.2 R160.2 U23.B6(MICBIAS2)
NetC79_1: C79.1 U23.H7(CPVOUTN)
NetC80_1: C80.1 CN27.4 U23.G6(HPOUT1R)
NetC80_2: C80.2 R161.1
NetC81_1: C81.1 CN27.6 U23.H6(HPOUT1L)
NetC81_2: C81.2 R162.1
NetC91_1: C91.1 U23.F1(DCVDD)
NetC92_1: C92.1 R183.1 R184.1
NetC92_2: C92.2 U23.A2(SPKOUTLP)
NetC101_1: C101.1 R208.2 R209.2
NetC101_2: C101.2 U23.B3(SPKOUTRP)
NetCN25_5: CN25.5(LR) R185.1
NetCN26_2: CN26.2 R211.1
NetCN26_3: CN26.3 R210.1
NetCN26_4: CN26.4 R209.1
NetCN26_6: CN26.6 R183.2
NetJP6_3: JP17.3 ; port I2S3_SD
NetJP17_1: JP17.1 U23.A9(IN2RN/DMICDAT2)
NetJP18_1: JP18.1 U23.C6(DMICCLK)
NetJP18_3: JP18.3 ; port MIC_CK
NetR171_1: R171.1 U23.D4(LDO1ENA) U23.D5(LDO2ENA)
NetR172_2: R172.2 U23.F3(SDA)
NetR178_2: R178.2 U23.G2(~{CS}/ADDR)
NetR179_2: R179.2 U23.H1(SCLK)
NetR186_1: R186.1 U25.2(LR)
NetSB5_1: U23.G1(BCLK1) ; port SAI1_SCKA
NetSB7_1: U23.E3(LRCLK1) ; port SAI1_FSA
NetSB9_1: U23.F2(ADCDAT1) ; port SAI1_SDB
NetSB19_1: U23.E4(DACDAT1) ; port SAI1_SDA
NetSB25_2: SB25.2 U25.3(CLK) U26.3(CLK)
NetSB26_1: SB26.1 U25.4(DOUT) U26.4(DOUT)
NetU22_15: U23.G3(ADCLRCLK1/GPIO1) ; port Audio_INT

Not connected (* = marked no-connect by the designer): CN25 6(NC); CN28 6(NC); U23 A6(LINEOUTFB) A8(IN2RP/VRXP) B1(SPKOUTLN) B4(LINEOUT2P) B5(LINEOUT1P) B7(IN1RN) B8(IN2LP/VRXN) B9(IN2LN/DMICDAT1) C3(SPKOUTRN) C4(LINEOUT2N) C5(LINEOUT1N) C7(IN1RP) C8(IN1LP) E1(GPIO2/MCLK2) E5(GPIO7/ADCDAT2) F4(GPIO4/LRCLK2) F5(GPIO9/ADCDAT3) F6(GPIO11/BCLK3) F8(HPOUT2P) F9(HPOUT2N) G4(GPIO6/ADCLRCLK2) H2(GPIO3/BCLK2) H3(GPIO5/DACDAT2) H4(GPIO8/DACDAT3) H5(GPIO10/LRCLK3)

### Notes on the sheet
- Default I2C Address:0011010
- PB9
- PB8
- PC7
- PE5
- PE4
- PG7
- To MFX
- PE6
- PE3
- MFX_GPIO5
- RIGHT
- (near U26) LEFT
- (near JP17) PD6
- (near C69) time slot0 of SAI
- (near JP17) time slot1 of SAI
- MICBIAS1
- LEFT
- Title:
- Project:
- Size:
- Date:
- A4
- Reference:
- Sheet:
- Revision:
- of

### Library data of the parts
C68 C70 C71 C73 C76 C78 C80 C81 C87-C90 C93 C104 = Cap: Capacitor; Value: 10nF; Published: 8-Jun-2000; Revision: July-2002: Re-released for DXP Platform.; Publisher: Altium Limited
C69 C72 C74 C75 C77 C79 C91 = CAP: Capacitor; Value: 100nF; Published: 8-Jun-2000; Revision: July-2002: Re-released for DXP Platform.; Publisher: Altium Limited
C92 C101 = Cap: Capacitor; Value: 10nF; Ordered by: Subcon; Published: 8-Jun-2000; Revision: July-2002: Re-released for DXP Platform.; Publisher: Altium Limited
CN25 CN28 = Coupon Connectors: Header, 3-Pin, Single row; Revision: 17-Jul-2002: Re-released for DXP Platform.; Publisher: Altium Limited
JP16-JP18 = Jumper3
R160-R162 R171 R172 R178 R179 R185 R186 R212 = Res1: Resistor; Value: 1K; Published: 8-Jun-2000; Revision: July-2002: Re-released for DXP Platform.; Publisher: Altium Limited
R183 R209-R211 = Res1: Resistor; Value: 1K; Ordered by: Subcon; Published: 8-Jun-2000; Revision: July-2002: Re-released for DXP Platform.; Publisher: Altium Limited
R184 R208 = Res1: Resistor; Ordered by: Subcon; Published: 8-Jun-2000; Revision: July-2002: Re-released for DXP Platform.; Publisher: Altium Limited; Value: 1K
SB25 SB26 = Circuit Breaker_close: Circuit Breaker; Published: 24-Mar-1999; Revision: July-2002: Re-released for DXP Platform.; Publisher: Altium Limited
U25 U26 = MP34DT01TR: MEMS audio sensor; Revision: 17-Jul-2002: Re-released for DXP Platform.; Publisher: Altium Limited

## Sheet CAN&QSPI.SchDoc: CAN & QSPI
size A4; DocumentNumber: MB1165; Revision: C.1; SheetNumber: 11; SheetTotal: 17; Project: STM32469I-EVAL
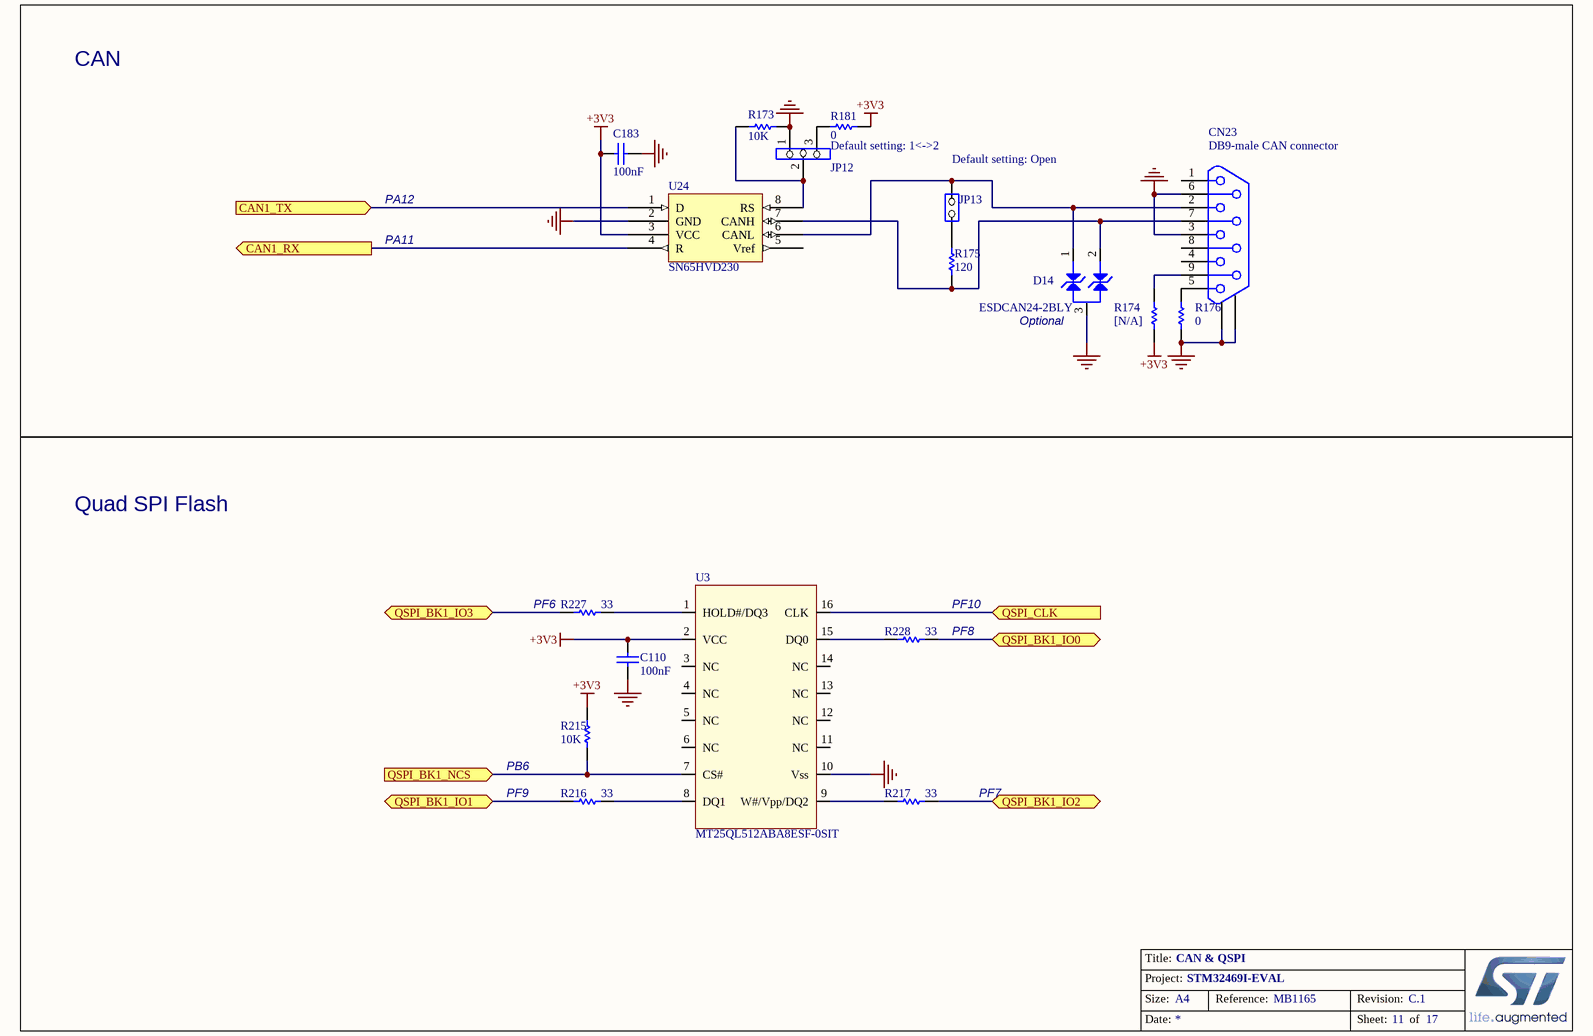
[diagram p2: CAN&QSPI.SchDoc]

### Parts
C110  100nF  [0402C]
C183  100nF  [0603C]
CN23  DB9-male CAN connector  [DB9/M]
D14  ESDCAN24-2BLY  [SOT-23]
JP12  (no value)  [SIP3]
JP13  (no value)  [SIP2]
R173  10K  [0603R]
R174  [N/A]  [0603R]
R175  120  [0603R]
R176  0  [0603R]
R181  0  [0603R]
R215  10K  [0402R]
R216  33  [0603R]
R217  33  [0603R]
R227  33  [0603R]
R228  33  [0603R]
U3  MT25QL512ABA8ESF-0SIT  [SOIC16W_1R27_10R3X10R33]
U24  SN65HVD230  [SOIC8_1R27_4R9X6]

### Ports
CAN1_RX (out), CAN1_TX (in), QSPI_BK1_IO0 (bidir), QSPI_BK1_IO1 (bidir), QSPI_BK1_IO2 (bidir), QSPI_BK1_IO3 (bidir), QSPI_BK1_NCS (in), QSPI_CLK (in)

### Nets
+3V3: C110.1 C183.1 R174.1 R181.2 R215.1 U3.2(VCC) U24.3(VCC)
GND: C110.2 C183.2 CN23.3 CN23.6 CN23.10 CN23.11 D14.3 JP12.1 R173.2 R176.1 U3.10(Vss) U24.2(GND)
PB6: R215.2 U3.7(CS#) ; port QSPI_BK1_NCS
PF6: R227.2 ; port QSPI_BK1_IO3
PF7: R217.1 ; port QSPI_BK1_IO2
PF8: R228.1 ; port QSPI_BK1_IO0
PF9: R216.2 ; port QSPI_BK1_IO1
PF10: U3.16(CLK) ; port QSPI_CLK
NetCN23_2: CN23.2 D14.1 JP13.2(NO) U24.6(CANL)
NetCN23_5: CN23.5 R176.2
NetCN23_7: CN23.7 D14.2 R175.1 U24.7(CANH)
NetCN23_9: CN23.9 R174.2
NetJP9_2: U24.4(R) ; port CAN1_RX
NetJP12_2: JP12.2 R173.1 U24.8(RS)
NetJP12_3: JP12.3 R181.1
NetJP13_1: JP13.1(COMMON) R175.2
NetR216_1: R216.1 U3.8(DQ1)
NetR217_2: R217.2 U3.9(W#/Vpp/DQ2)
NetR227_1: R227.1 U3.1(HOLD#/DQ3)
NetR228_2: R228.2 U3.15(DQ0)
NetSB67_1: U24.1(D) ; port CAN1_TX

Not connected (* = marked no-connect by the designer): CN23 1 4 8; U3 3(NC) 4(NC) 5(NC) 6(NC) 11(NC) 12(NC) 13(NC) 14(NC); U24 5(Vref)

### Notes on the sheet
- CAN
- Default setting: 1<->2
- (near JP13) Default setting: Open
- PA12
- PA11
- (near D14) Optional
- Quad SPI Flash
- (near R227) PF6
- (near R228) PF8
- (near R228) PF10
- PB6
- PF9
- (near R217) PF7
- Title:
- Project:
- Size:
- Date:
- A4
- Reference:
- Sheet:
- Revision:
- of

### Library data of the parts
C110 = Cap: as C92 on sheet Audio; Published: 8-Jun-2000; Revision: July-2002: Re-released for DXP Platform.; Publisher: Altium Limited
C183 = Cap: Capacitor; Value: 10nF; Published: 8-Jun-2000; Revision: July-2002: Re-released for DXP Platform.; Publisher: Altium Limited
CN23 = DB9-CAN
JP12 = Jumper3
JP13 = JP2
R173 R216 R217 R227 R228 = Res1: Resistor; Value: 1K; Published: 8-Jun-2000; Revision: July-2002: Re-released for DXP Platform.; Publisher: Altium Limited
R174-R176 R181 = res1: Resistor; Value: 1K; Published: 8-Jun-2000; Revision: July-2002: Re-released for DXP Platform.; Publisher: Altium Limited
R215 = res1: Resistor; Value: 1K; Ordered by: Subcon; Published: 8-Jun-2000; Revision: July-2002: Re-released for DXP Platform.; Publisher: Altium Limited
U3 = QSPI_16pins: ECCN_US/EU: 3A991
U24 = SN65HVD230D

## Sheet Ethernet.SchDoc: Ethernet
size A4; DocumentNumber: MB1165; Revision: C.1; SheetNumber: 7; SheetTotal: 17; Project: STM32469I-EVAL
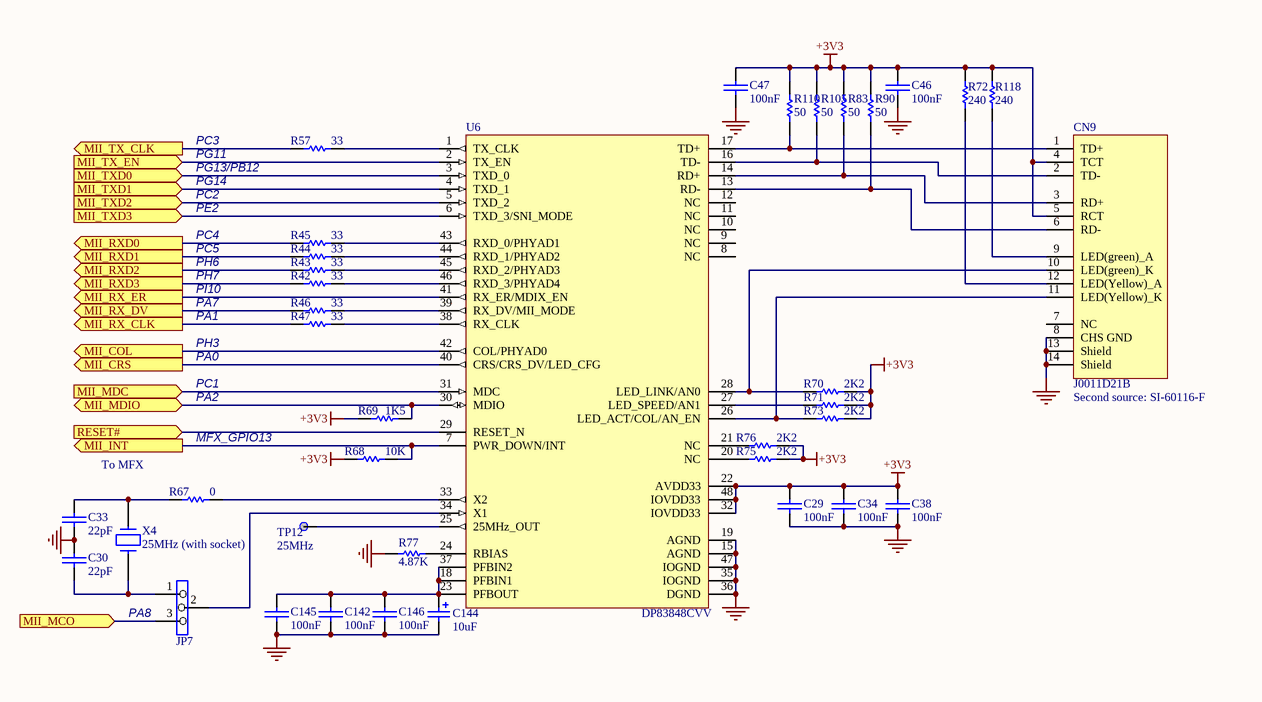
[diagram p3: Ethernet.SchDoc]

### Parts
C29  100nF  [0603C]
C30  22pF  [0603C]
C33  22pF  [0603C]
C34  100nF  [0603C]
C38  100nF  [0603C]
C46  100nF  [0603C]
C47  100nF  [0603C]
C142  100nF  [0603C]
C144  10uF  [TAN-A]
C145  100nF  [0603C]
C146  100nF  [0603C]
CN9  J0011D21B  [RJ45_J0011D01BNL]
JP7  (no value)  [SIP3]
R42  33  [0603R]
R43  33  [0603R]
R44  33  [0603R]
R45  33  [0603R]
R46  33  [0603R]
R47  33  [0603R]
R57  33  [0603R]
R67  0  [0603R]
R68  10K  [0603R]
R69  1K5  [0603R]
R70  2K2  [0603R]
R71  2K2  [0603R]
R72  240  [0603R]
R73  2K2  [0603R]
R75  2K2  [0603R]
R76  2K2  [0603R]
R77  4.87K  [0603R]
R83  50  [0603R]
R90  50  [0603R]
R105  50  [0603R]
R110  50  [0603R]
R118  240  [0603R]
TP12  25MHz  [TP]
U6  DP83848CVV  [LQFP48_0R5_9X9]
X4  25MHz (with socket)  [XTAL_socket]

### Ports
MII_COL (out), MII_CRS (out), MII_INT (out), MII_MCO (in), MII_MDC (in), MII_MDIO (bidir), MII_RX_CLK (out), MII_RX_DV (out), MII_RX_ER (out), MII_RXD0 (out), MII_RXD1 (out), MII_RXD2 (out), MII_RXD3 (out), MII_TX_CLK (out), MII_TX_EN (in), MII_TXD0 (in), MII_TXD1 (in), MII_TXD2 (in), MII_TXD3 (in), RESET# (in)

### Nets
+3V3: C29.1 C34.2 C38.2 C46.2 C47.2 CN9.4(TCT) CN9.5(RCT) R68.1 R69.2 R70.2 R71.2 R72.2 R73.2 R75.2 R76.2 R83.1 R90.1 R105.1 R110.1 R118.2 U6.22(AVDD33) U6.32(IOVDD33) U6.48(IOVDD33)
GND: C29.2 C30.2 C33.1 C34.1 C38.1 C46.1 C47.1 C142.1 C144.2 C145.2 C146.1 CN9.8(CHS_GND) CN9.13(Shield) CN9.14(Shield) R77.1 U6.15(AGND) U6.19(AGND) U6.35(IOGND) U6.36(DGND) U6.47(IOGND)
MII_TXD0: U6.3(TXD_0) ; port MII_TXD0
PH7: R42.2 ; port MII_RXD3
RESET#: U6.29(RESET_N) ; port RESET#
NetC30_1: C30.1 JP7.1 X4.1
NetC33_2: C33.2 R67.2 X4.2
NetC142_2: C142.2 C144.1 C145.1 C146.2 U6.18(PFBIN1) U6.23(PFBOUT) U6.37(PFBIN2)
NetCN9_1: CN9.1(TD+) R110.2 U6.17(TD+)
NetCN9_2: CN9.2(TD-) R105.2 U6.16(TD-)
NetCN9_3: CN9.3(RD+) R83.2 U6.14(RD+)
NetCN9_6: CN9.6(RD-) R90.2 U6.13(RD-)
NetCN9_9: CN9.9(LED(green)_A) R118.1
NetCN9_10: CN9.10(LED(green)_K) R70.1 U6.28(LED_LINK/AN0)
NetCN9_11: CN9.11(LED(Yellow)_K) R73.1 U6.26(LED_ACT/COL/AN_EN)
NetCN9_12: CN9.12(LED(Yellow)_A) R72.1
NetJP7_2: JP7.2 U6.34(X1)
NetJP7_3: JP7.3 ; port MII_MCO
NetR42_1: R42.1 U6.46(RXD_3/PHYAD4)
NetR43_1: R43.1 U6.45(RXD_2/PHYAD3)
NetR43_2: R43.2 ; port MII_RXD2
NetR44_1: R44.1 U6.44(RXD_1/PHYAD2)
NetR44_2: R44.2 ; port MII_RXD1
NetR45_1: R45.1 U6.43(RXD_0/PHYAD1)
NetR45_2: R45.2 ; port MII_RXD0
NetR46_1: R46.1 U6.39(RX_DV/MII_MODE)
NetR46_2: R46.2 ; port MII_RX_DV
NetR47_1: R47.1 U6.38(RX_CLK)
NetR47_2: R47.2 ; port MII_RX_CLK
NetR57_1: R57.1 U6.1(TX_CLK)
NetR57_2: R57.2 ; port MII_TX_CLK
NetR67_1: R67.1 U6.33(X2)
NetR68_2: R68.2 U6.7(PWR_DOWN/INT) ; port MII_INT
NetR69_1: R69.1 U6.30(MDIO) ; port MII_MDIO
NetR71_1: R71.1 U6.27(LED_SPEED/AN1)
NetR75_1: R75.1 U6.20(NC)
NetR76_1: R76.1 U6.21(NC)
NetR77_2: R77.2 U6.24(RBIAS)
NetR233_2: U6.5(TXD_2) ; port MII_TXD2
NetR235_2: U6.4(TXD_1) ; port MII_TXD1
NetR238_1: U6.6(TXD_3/SNI_MODE) ; port MII_TXD3
NetR242_2: U6.2(TX_EN) ; port MII_TX_EN
NetSB12_2: U6.41(RX_ER/MDIX_EN) ; port MII_RX_ER
NetSB31_2: U6.31(MDC) ; port MII_MDC
NetSB48_1: U6.40(CRS/CRS_DV/LED_CFG) ; port MII_CRS
NetSB63_2: U6.42(COL/PHYAD0) ; port MII_COL
NetTP12_1: TP12.1 U6.25(25MHz_OUT)

Not connected (* = marked no-connect by the designer): CN9 7(NC); U6 8(NC) 9(NC) 10(NC) 11(NC) 12(NC)

### Notes on the sheet
- PC3
- PG11
- PG13/PB12
- PG14
- PC2
- PE2
- PC4
- PC5
- PH6
- PH7
- PI10
- PA7
- PH3
- PA1
- PA0
- PC1
- PA2
- (near CN9) Second source: SI-60116-F
- To MFX
- MFX_GPIO13
- (near JP7) PA8
- Title:
- Project:
- Size:
- Date:
- A4
- Reference:
- Sheet:
- Revision:
- of

### Library data of the parts
C29 C30 C33 C34 C38 C46 C47 C142 C145 C146 = CAP: Capacitor
C144 = Cap Pol1: Polarized Capacitor (Radial); Published: 8-Jun-2000; Revision: July-2002: Re-released for DXP Platform.; Publisher: Altium Limited; Value: 10uF
JP7 = Jumper3
R42-R47 R57 R67-R73 R75-R77 R83 R90 R105 R110 R118 = Res1: Resistor; Value: 1K; Published: 8-Jun-2000; Revision: July-2002: Re-released for DXP Platform.; Publisher: Altium Limited
TP12 = TP
X4 = CRYSTAL

## Sheet ExtensionConnector.SchDoc: Extension Connectors
size A4; DocumentNumber: MB1165; Revision: C.1; SheetNumber: 14; SheetTotal: 17; Project: STM32469I-EVAL
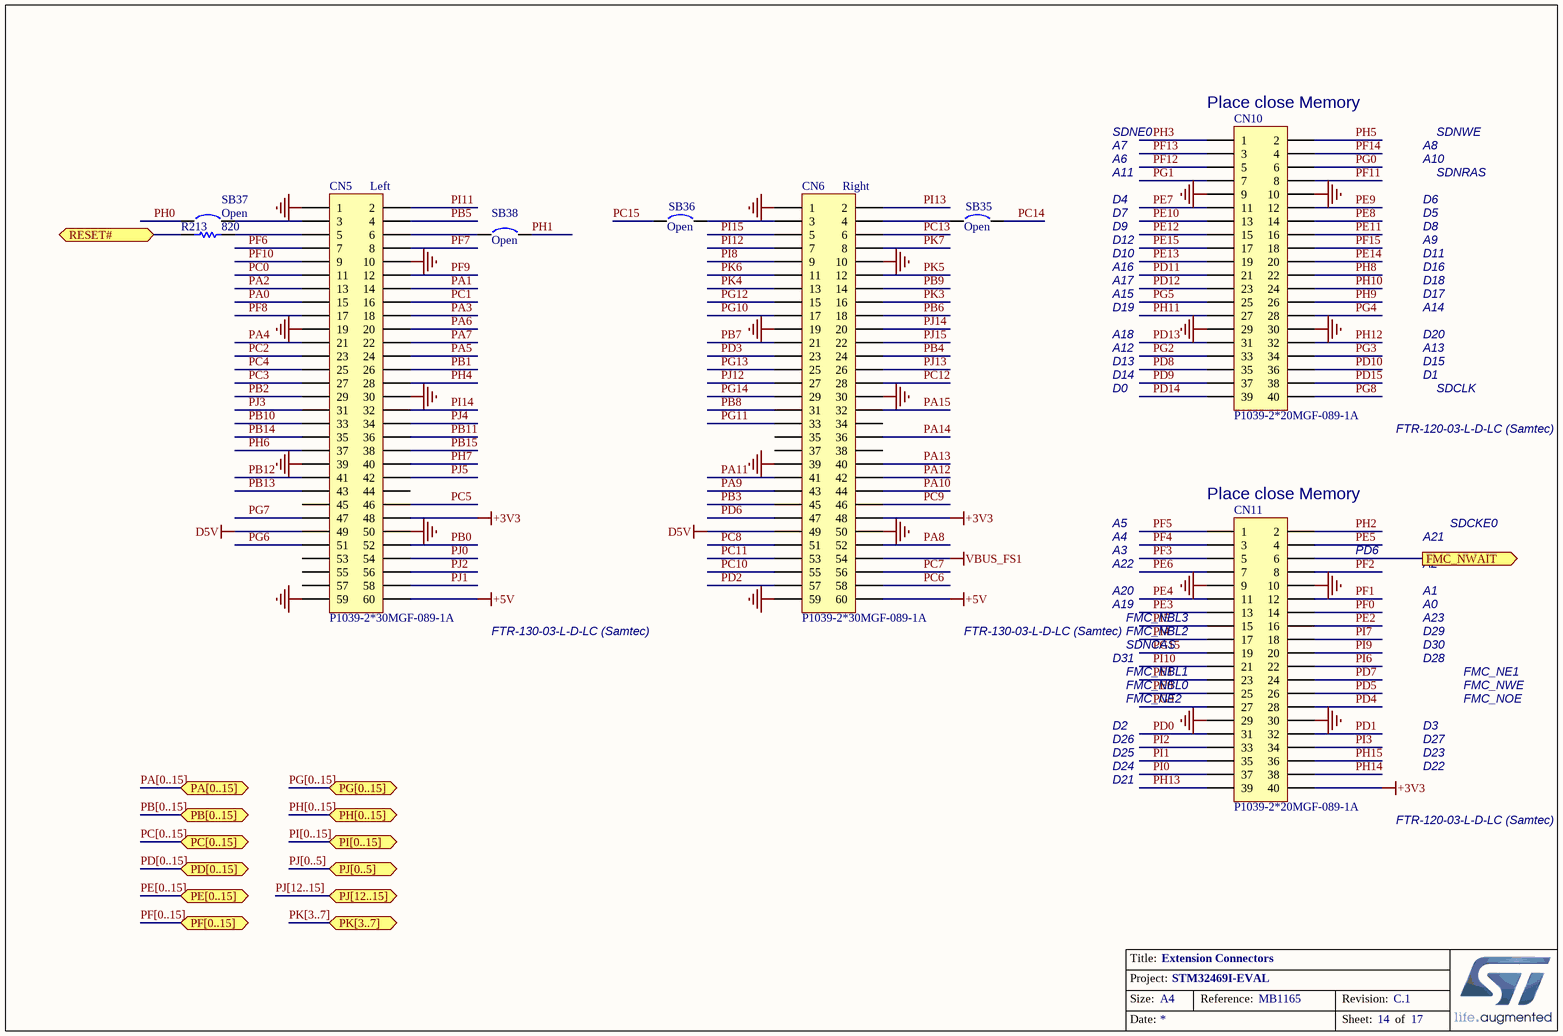
[diagram p4: ExtensionConnector.SchDoc]

### Parts
CN5  P1039-2*30MGF-089-1A  [FTR-130-53-L-D-LC]
CN6  P1039-2*30MGF-089-1A  [FTR-130-53-L-D-LC]
CN10  P1039-2*20MGF-089-1A  [FTR-120-53-L-D-LC]
CN11  P1039-2*20MGF-089-1A  [FTR-120-53-L-D-LC]
R213  820  [0603R]
SB35  Open  [SB_0603]
SB36  Open  [SB_0603]
SB37  Open  [SB_0603]
SB38  Open  [SB_0603]

### Ports
FMC_NWAIT (out), PA[0..15] (bidir), PB[0..15] (bidir), PC[0..15] (bidir), PD[0..15] (bidir), PE[0..15] (bidir), PF[0..15] (bidir), PG[0..15] (bidir), PH[0..15] (bidir), PI[0..15] (bidir), PJ[0..5] (bidir), PJ[12..15] (bidir), PK[3..7] (bidir), RESET# (bidir)

### Nets
+3V3: CN5.48 CN6.48 CN11.40
+5V: CN5.60 CN6.60
D5V: CN5.49 CN6.49
GND: CN5.1 CN5.10 CN5.19 CN5.30 CN5.39 CN5.50 CN5.59 CN6.1 CN6.10 CN6.19 CN6.30 CN6.39 CN6.50 CN6.59 CN10.9 CN10.10 CN10.29 CN10.30 CN11.9 CN11.10 CN11.29 CN11.30
VBUS_FS1: CN6.54
PA0: CN5.15
PA1: CN5.14
PA2: CN5.13
PA3: CN5.18
PA4: CN5.21
PA5: CN5.24
PA6: CN5.20
PA7: CN5.22
PA8: CN6.52
PA9: CN6.43
PA10: CN6.44
PA11: CN6.41
PA12: CN6.42
PA13: CN6.40
PA14: CN6.36
PA15: CN6.32
PB0: CN5.52
PB1: CN5.26
PB2: CN5.29
PB3: CN6.45
PB4: CN6.24
PB5: CN5.4
PB6: CN6.18
PB7: CN6.21
PB8: CN6.31  [project net I2C1_SCL]
PB9: CN6.14  [project net I2C1_SDA]
PB10: CN5.33
PB11: CN5.36
PB12: CN5.41
PB13: CN5.43
PB14: CN5.35
PB15: CN5.38
PC0: CN5.11
PC1: CN5.16
PC2: CN5.23
PC3: CN5.27
PC4: CN5.25
PC5: CN5.46
PC6: CN6.58  [project net I2S3_CK]
PC7: CN6.56  [project net PAR_D1]
PC8: CN6.51  [project net PAR_D2]
PC9: CN6.46  [project net PAR_D3]
PC10: CN6.55  [project net PAR_D8]
PC11: CN6.53  [project net PAR_D4]
PC12: CN6.28  [project net PAR_D9]
PC13: CN6.6
PC14: SB35.1
PC15: SB36.1
PD0: CN11.31  [project net D2]
PD1: CN11.32  [project net D3]
PD2: CN6.57  [project net PAR_D11]
PD3: CN6.23  [project net PAR_D5]
PD4: CN11.28
PD5: CN11.26
PD6: CN6.47  [project net PAR_D10]
PD7: CN11.24
PD8: CN10.35  [project net D13]
PD9: CN10.37  [project net D14]
PD10: CN10.36  [project net D15]
PD11: CN10.21  [project net A16]
PD12: CN10.23  [project net A17]
PD13: CN10.31  [project net A18]
PD14: CN10.39  [project net D0]
PD15: CN10.38  [project net D1]
PE0: CN11.25
PE1: CN11.23
PE2: CN11.16  [project net A23]
PE3: CN11.13  [project net A19]
PE4: CN11.11  [project net A20]
PE5: CN11.4  [project net A21]
PE6: CN11.7  [project net A22]
PE7: CN10.11  [project net D4]
PE8: CN10.14  [project net D5]
PE9: CN10.12  [project net D6]
PE10: CN10.13  [project net D7]
PE11: CN10.16  [project net D8]
PE12: CN10.15  [project net D9]
PE13: CN10.19  [project net D10]
PE14: CN10.20  [project net D11]
PE15: CN10.17  [project net D12]
PF0: CN11.14  [project net A0]
PF1: CN11.12  [project net A1]
PF2: CN11.8  [project net A2]
PF3: CN11.5  [project net A3]
PF4: CN11.3  [project net A4]
PF5: CN11.1  [project net A5]
PF6: CN5.7
PF7: CN5.8
PF8: CN5.17
PF9: CN5.12
PF10: CN5.9
PF11: CN10.8
PF12: CN10.5  [project net A6]
PF13: CN10.3  [project net A7]
PF14: CN10.4  [project net A8]
PF15: CN10.18  [project net A9]
PG0: CN10.6  [project net A10]
PG1: CN10.7  [project net A11]
PG2: CN10.33  [project net A12]
PG3: CN10.34  [project net A13]
PG4: CN10.28  [project net A14]
PG5: CN10.25  [project net A15]
PG6: CN5.51  [project net LCD_R7]
PG7: CN5.47
PG8: CN10.40
PG9: CN11.27
PG10: CN6.17  [project net LCD_G3]
PG11: CN6.33
PG12: CN6.15  [project net LCD_B1]
PG13: CN6.25
PG14: CN6.29
PG15: CN11.19
PH0: SB37.1
PH1: SB38.1
PH2: CN11.2
PH3: CN10.1
PH4: CN5.28
PH5: CN10.2
PH6: CN5.37
PH7: CN5.40
PH8: CN10.22  [project net D16]
PH9: CN10.26  [project net D17]
PH10: CN10.24  [project net D18]
PH11: CN10.27  [project net D19]
PH12: CN10.32  [project net D20]
PH13: CN11.39  [project net D21]
PH14: CN11.38  [project net D22]
PH15: CN11.36  [project net D23]
PI0: CN11.37  [project net D24]
PI1: CN11.35  [project net D25]
PI2: CN11.33  [project net D26]
PI3: CN11.34  [project net D27]
PI4: CN11.17
PI5: CN11.15
PI6: CN11.22  [project net D28]
PI7: CN11.18  [project net D29]
PI8: CN6.9
PI9: CN11.20  [project net D30]
PI10: CN11.21  [project net D31]
PI11: CN5.2
PI12: CN6.7
PI13: CN6.2
PI14: CN5.32
PI15: CN6.5  [project net LCD_G2]
PJ0: CN5.54  [project net LCD_R1]
PJ1: CN5.58  [project net LCD_R2]
PJ2: CN5.56  [project net LCD_R3]
PJ3: CN5.31  [project net LCD_R4]
PJ4: CN5.34  [project net LCD_R5]
PJ5: CN5.42  [project net LCD_R6]
PJ12: CN6.27  [project net LCD_B0]
PJ13: CN6.26  [project net LCD_G4]
PJ14: CN6.20  [project net LCD_B2]
PJ15: CN6.22  [project net LCD_B3]
PK3: CN6.16  [project net LCD_B4]
PK4: CN6.13  [project net LCD_B5]
PK5: CN6.12  [project net LCD_B6]
PK6: CN6.11  [project net LCD_B7]
PK7: CN6.8
RESET#: R213.1 ; port RESET#
NetCN5_3: CN5.3 SB37.2
NetCN5_5: CN5.5 R213.2
NetCN5_6: CN5.6 SB38.2
NetCN6_3: CN6.3 SB36.2
NetCN6_4: CN6.4 SB35.2
NetCN11_6: CN11.6 ; port FMC_NWAIT

Not connected (* = marked no-connect by the designer): CN5 44 45 53 55 57; CN6 34 35 37 38

### Buses and harness runs
bus PA[0..15] = port PA[0..15]
bus PB[0..15] = port PB[0..15]
bus PC[0..15] = port PC[0..15]
bus PD[0..15] = port PD[0..15]
bus PE[0..15] = port PE[0..15]
bus PF[0..15] = port PF[0..15]
bus PG[0..15] = port PG[0..15]
bus PH[0..15] = port PH[0..15]
bus PI[0..15] = port PI[0..15]
bus PJ[0..5] = port PJ[0..5]
bus PJ[12..15] = port PJ[12..15]
bus PK[3..7] = port PK[3..7]

### Notes on the sheet
- (near CN10) Place close Memory
- A6
- A7
- A11
- SDNE0
- A8
- A10
- SDNRAS
- SDNWE
- (near CN5) Left
- (near CN6) Right
- D4
- D7
- D9
- D12
- D5
- D6
- D8
- A9
- A16
- A17
- D10
- A15
- D19
- D11
- A14
- D16
- D17
- D18
- D13
- D14
- A18
- A12
- D15
- D1
- A13
- D20
- D0
- (near CN10) FTR-120-03-L-D-LC (Samtec)
- SDCLK
- (near CN11) Place close Memory
- A22
- A3
- A4
- A5
- PD6
- A21
- A2
- SDCKE0
- (near CN5) FTR-130-03-L-D-LC (Samtec)
- (near CN6) FTR-130-03-L-D-LC (Samtec)
- A19
- A20
- SDNCAS
- FMC_NBL2
- FMC_NBL3
- A23
- A0
- A1
- D29
- D30
- D31
- FMC_NBL0
- FMC_NBL1
- FMC_NE2
- D28
- FMC_NOE
- FMC_NWE
- FMC_NE1
- D2
- D21
- D24
- D25
- D26
- D3
- D22
- D23
- D27
- (near CN11) FTR-120-03-L-D-LC (Samtec)
- Title:
- Project:
- Size:
- Date:
- Reference:
- Sheet:
- Revision:
- of

### Library data of the parts
CN5 CN6 = FTR-130-53-L-D-LC: Header, 40-Pin, Dual row; Revision: 17-Jul-2002: Re-released for DXP Platform.; Publisher: Altium Limited
CN10 CN11 = FTR-120-53-L-D-LC: Header, 20-Pin, Dual row; Revision: 17-Jul-2002: Re-released for DXP Platform.; Publisher: Altium Limited
R213 = res1: Resistor; Value: 1K; Published: 8-Jun-2000; Revision: July-2002: Re-released for DXP Platform.; Publisher: Altium Limited
SB35-SB38 = Circuit Breaker: Published: 24-Mar-1999; Revision: July-2002: Re-released for DXP Platform.; Publisher: Altium Limited

## Sheet JTAG&Trace.SchDoc: JTAG & Trace
size A4; DocumentNumber: MB1165; Revision: C.1; SheetNumber: 17; SheetTotal: 17; Project: STM32469I-EVAL
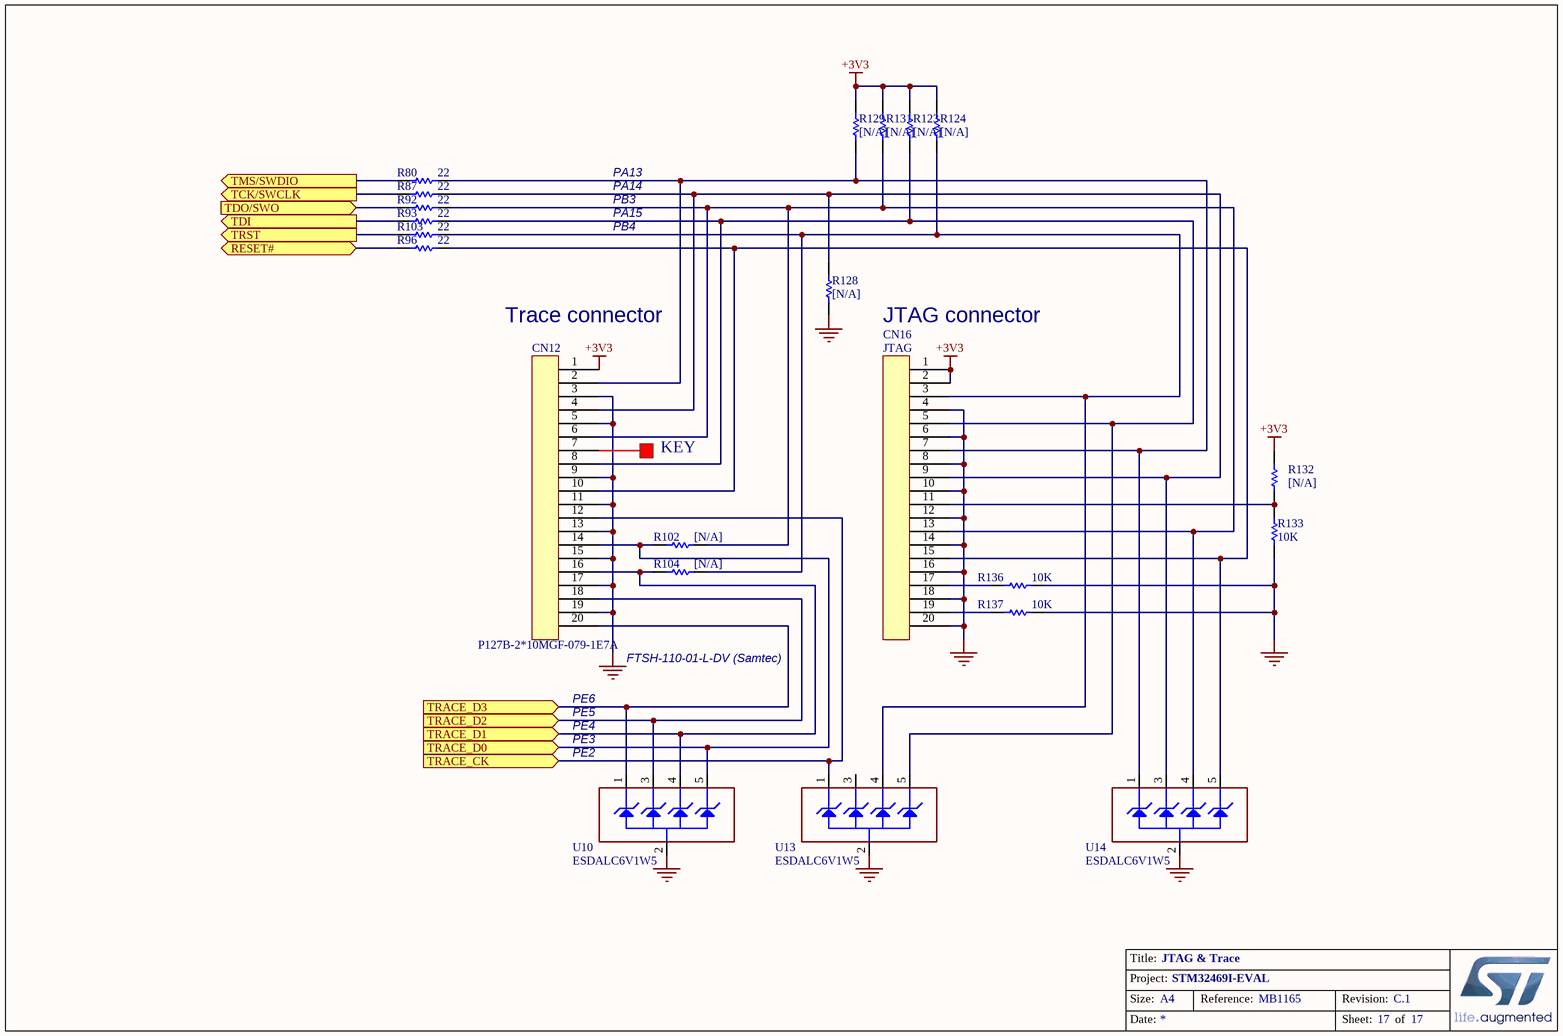
[diagram p5: JTAG&Trace.SchDoc]

### Parts
CN12  P127B-2*10MGF-079-1E7A  [FTSH-110-01-L-DV]
CN16  JTAG  [IDC20S]
R80  22  [0603R]
R87  22  [0603R]
R92  22  [0603R]
R93  22  [0603R]
R96  22  [0603R]
R102  [N/A]  [0603R]
R103  22  [0603R]
R104  [N/A]  [0603R]
R123  [N/A]  [0603R]
R124  [N/A]  [0603R]
R128  [N/A]  [0603R]
R129  [N/A]  [0603R]
R131  [N/A]  [0603R]
R132  [N/A]  [0603R]
R133  10K  [0603R]
R136  10K  [0603R]
R137  10K  [0603R]
U10  ESDALC6V1W5  [SOT-353]
U13  ESDALC6V1W5  [SOT-353]
U14  ESDALC6V1W5  [SOT-353]

### Ports
RESET# (bidir), TCK/SWCLK (out), TDI (out), TDO/SWO (in), TMS/SWDIO (out), TRACE_CK (in), TRACE_D0 (in), TRACE_D1 (in), TRACE_D2 (in), TRACE_D3 (in), TRST (out)

### Nets
+3V3: CN12.1 CN16.1 CN16.2 R123.2 R124.2 R129.2 R131.2 R132.2
GND: CN12.3 CN12.5 CN12.9 CN12.11 CN12.13 CN12.15 CN12.17 CN12.19 CN16.4 CN16.6 CN16.8 CN16.10 CN16.12 CN16.14 CN16.16 CN16.18 CN16.20 R128.1 R133.1 R136.1 R137.1 U10.2(GND) U13.2(GND) U14.2(GND)
PA13: R80.2 ; port TMS/SWDIO
PA14: R87.2 ; port TCK/SWCLK
PA15: R93.2 ; port TDI
PB4: R103.2 ; port TRST
RESET#: R96.2 ; port RESET#
T_JTDO: R92.2 ; port TDO/SWO
NetCN12_2: CN12.2 CN16.7 R80.1 R129.1 U14.1(IO1)
NetCN12_4: CN12.4 CN16.9 R87.1 R128.2 U14.3(IO2)
NetCN12_6: CN12.6 CN16.13 R92.1 R102.2 R131.1 U14.4(IO3)
NetCN12_8: CN12.8 CN16.5 R93.1 R123.1 U13.5(IO4)
NetCN12_10: CN12.10 CN16.15 R96.1 U14.5(IO4)
NetCN12_12: CN12.12 U13.1(IO1) ; port TRACE_CK
NetCN12_14: CN12.14 R102.1 U10.5(IO4) ; port TRACE_D0
NetCN12_16: CN12.16 R104.1 U10.4(IO3) ; port TRACE_D1
NetCN12_18: CN12.18 U10.3(IO2) ; port TRACE_D2
NetCN12_20: CN12.20 U10.1(IO1) ; port TRACE_D3
NetCN16_3: CN16.3 R103.1 R104.2 R124.1 U13.4(IO3)
NetCN16_11: CN16.11 R132.1 R133.2
NetCN16_17: CN16.17 R136.2
NetCN16_19: CN16.19 R137.2

Not connected (* = marked no-connect by the designer): CN12 7; U13 3(IO2)

### Notes on the sheet
- PA13
- PA14
- PB3
- PA15
- PB4
- (near CN12) Trace connector
- JTAG connector
- KEY
- PE6
- PE5
- (near CN12) FTSH-110-01-L-DV (Samtec)
- PE4
- PE3
- (near U10) PE2
- Title:
- Project:
- Size:
- Date:
- A4
- Reference:
- Sheet:
- Revision:
- of

### Library data of the parts
CN12 CN16 = 20PIN1
R80 R87 R92 R93 R96 R102-R104 R123 R124 R128 R129 R131-R133 R136 R137 = Res1: Resistor; Value: 1K; Published: 8-Jun-2000; Revision: July-2002: Re-released for DXP Platform.; Publisher: Altium Limited
U10 U13 U14 = ESDALC6V1W5: Dual Transil array for ESD protection; Manuf_1: STM; Manuf_Part_1: ESDA5V3L; Ref St: 9179034; Provided: ST; ECCN_US/EU: EAR99/NEC; Distrib: ST; Order: ESDA5V3L; Ordered by: STM

## Sheet Memory.SchDoc: SRAM & FLASH & SDRAM
size A4; DocumentNumber: MB1165; Revision: C.1; SheetNumber: 4; SheetTotal: 17; Project: STM32469I-EVAL
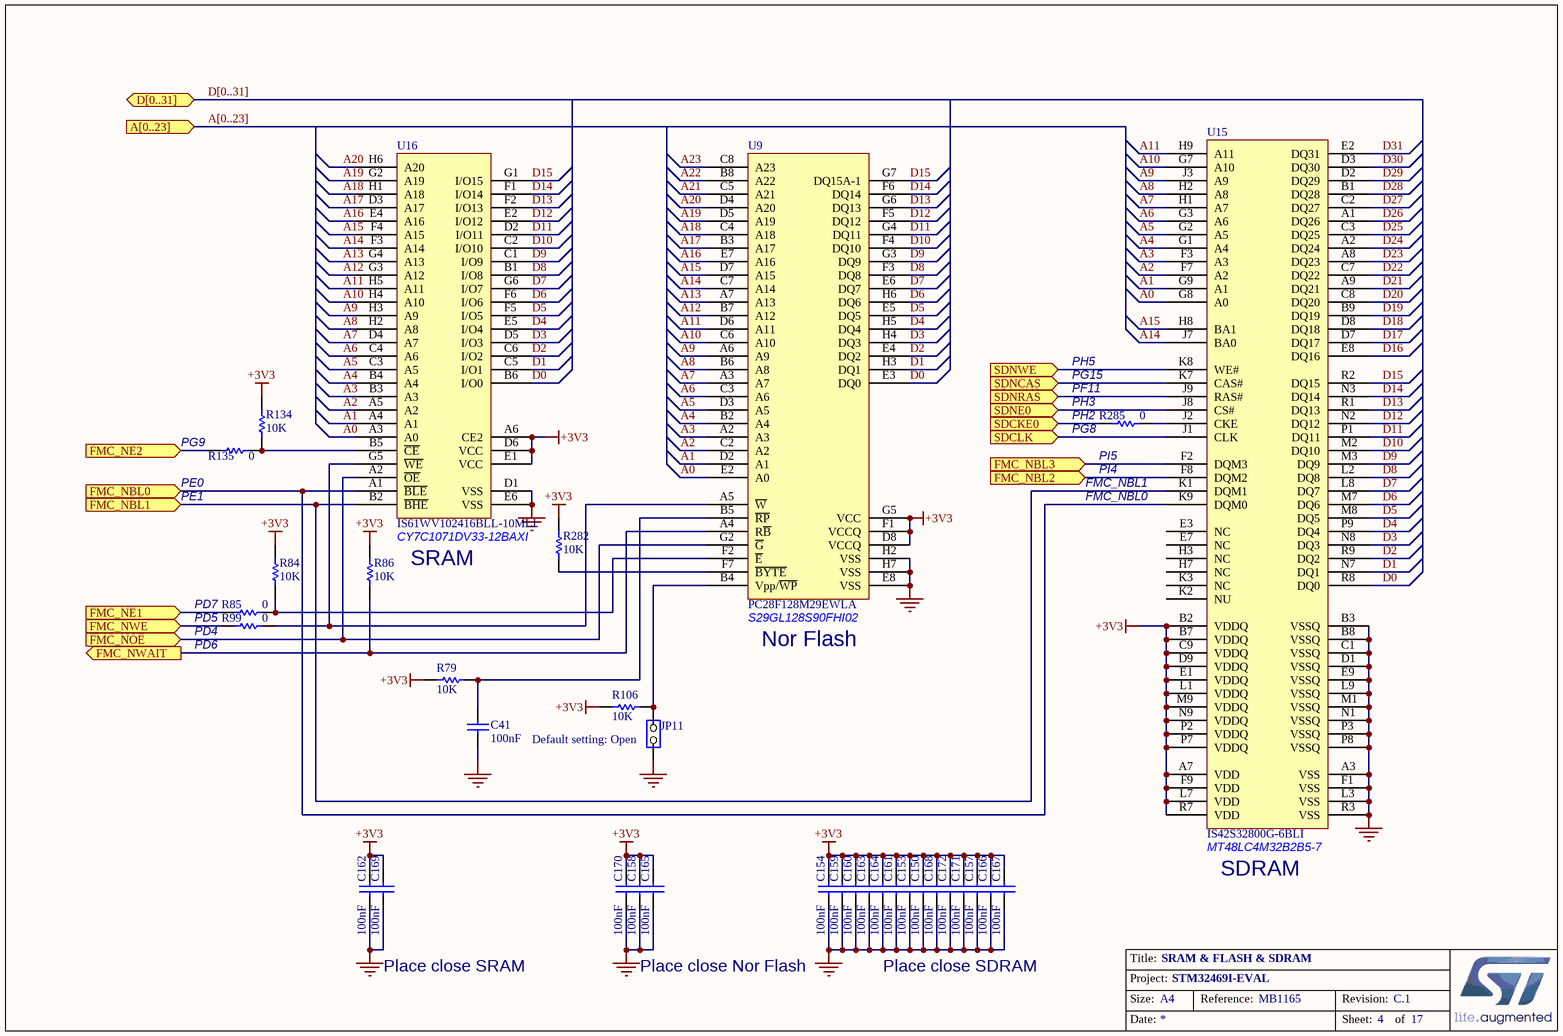
[diagram p6: Memory.SchDoc]

### Parts
C41  100nF  [0603C]
C150  100nF  [0603C]
C153  100nF  [0603C]
C154  100nF  [0603C]
C157  100nF  [0603C]
C158  100nF  [0603C]
C159  100nF  [0603C]
C160  100nF  [0603C]
C161  100nF  [0603C]
C162  100nF  [0603C]
C163  100nF  [0603C]
C164  100nF  [0603C]
C165  100nF  [0603C]
C166  100nF  [0603C]
C167  100nF  [0603C]
C168  100nF  [0603C]
C169  100nF  [0603C]
C170  100nF  [0603C]
C171  100nF  [0603C]
C172  100nF  [0603C]
JP11  (no value)  [SIP2]
R79  10K  [0603R]
R84  10K  [0603R]
R85  0  [0603R]
R86  10K  [0603R]
R99  0  [0603R]
R106  10K  [0603R]
R134  10K  [0603R]
R135  0  [0603R]
R282  10K  [0603R]
R285  0  [0603R]
U9  PC28F128M29EWLA  [FBGA64_1_11X13]
U15  IS42S32800G-6BLI  [FBGA90_0R8_8X13]
U16  IS61WV102416BLL-10MLI  [BGA48_0R75_9X11]

### Ports
A[0..23] (in), D[0..31] (bidir), FMC_NBL0 (in), FMC_NBL1 (in), FMC_NBL2 (in), FMC_NBL3 (in), FMC_NE1 (in), FMC_NE2 (in), FMC_NOE (in), FMC_NWAIT (out), FMC_NWE (in), SDCKE0 (in), SDCLK (in), SDNCAS (in), SDNE0 (in), SDNRAS (in), SDNWE (in)

### Nets
+3V3: C150.1 C153.1 C154.1 C157.1 C158.1 C159.1 C160.1 C161.1 C162.1 C163.1 C164.1 C165.1 C166.1 C167.1 C168.1 C169.1 C170.1 C171.1 C172.1 R79.1 R84.2 R86.2 R106.2 R134.2 R282.2 U9.D8(VCCQ) U9.F1(VCCQ) U9.G5(VCC) U15.A7(VDD) U15.B2(VDDQ) U15.B7(VDDQ) U15.C9(VDDQ) U15.D9(VDDQ) U15.E1(VDDQ) U15.F9(VDD) U15.L1(VDDQ) U15.L7(VDD) U15.M9(VDDQ) U15.N9(VDDQ) U15.P2(VDDQ) U15.P7(VDDQ) U15.R7(VDD) U16.A6(CE2) U16.D6(VCC) U16.E1(VCC)
GND: C41.2 C150.2 C153.2 C154.2 C157.2 C158.2 C159.2 C160.2 C161.2 C162.2 C163.2 C164.2 C165.2 C166.2 C167.2 C168.2 C169.2 C170.2 C171.2 C172.2 JP11.1(COMMON) U9.E8(VSS) U9.H2(VSS) U9.H7(VSS) U15.A3(VSS) U15.B3(VSSQ) U15.B8(VSSQ) U15.C1(VSSQ) U15.D1(VSSQ) U15.E9(VSSQ) U15.F1(VSS) U15.L3(VSS) U15.L9(VSSQ) U15.M1(VSSQ) U15.N1(VSSQ) U15.P3(VSSQ) U15.P8(VSSQ) U15.R3(VSS) U16.D1(VSS) U16.E6(VSS)
A0: U9.E2(A0) U15.G8(A0) U16.A3(A0)
A1: U9.D2(A1) U15.G9(A1) U16.A4(A1)
A2: U9.C2(A2) U15.F7(A2) U16.A5(A2)
A3: U9.A2(A3) U15.F3(A3) U16.B3(A3)
A4: U9.B2(A4) U15.G1(A4) U16.B4(A4)
A5: U9.D3(A5) U15.G2(A5) U16.C3(A5)
A6: U9.C3(A6) U15.G3(A6) U16.C4(A6)
A7: U9.A3(A7) U15.H1(A7) U16.D4(A7)
A8: U9.B6(A8) U15.H2(A8) U16.H2(A8)
A9: U9.A6(A9) U15.J3(A9) U16.H3(A9)
A10: U9.C6(A10) U15.G7(A10) U16.H4(A10)
A11: U9.D6(A11) U15.H9(A11) U16.H5(A11)
A12: U9.B7(A12) U16.G3(A12)
A13: U9.A7(A13) U16.G4(A13)
A14: U9.C7(A14) U15.J7(BA0) U16.F3(A14)
A15: U9.D7(A15) U15.H8(BA1) U16.F4(A15)
A16: U9.E7(A16) U16.E4(A16)
A17: U9.B3(A17) U16.D3(A17)
A18: U9.C4(A18) U16.H1(A18)
A19: U9.D5(A19) U16.G2(A19)
A20: U9.D4(A20) U16.H6(A20)
A21: U9.C5(A21)
A22: U9.B8(A22)
A23: U9.C8(A23)
D0: U9.E3(DQ0) U15.R8(DQ0) U16.B6(I/O0)
D1: U9.H3(DQ1) U15.N7(DQ1) U16.C5(I/O1)
D2: U9.E4(DQ2) U15.R9(DQ2) U16.C6(I/O2)
D3: U9.H4(DQ3) U15.N8(DQ3) U16.D5(I/O3)
D4: U9.H5(DQ4) U15.P9(DQ4) U16.E5(I/O4)
D5: U9.E5(DQ5) U15.M8(DQ5) U16.F5(I/O5)
D6: U9.H6(DQ6) U15.M7(DQ6) U16.F6(I/O6)
D7: U9.E6(DQ7) U15.L8(DQ7) U16.G6(I/O7)
D8: U9.F3(DQ8) U15.L2(DQ8) U16.B1(I/O8)
D9: U9.G3(DQ9) U15.M3(DQ9) U16.C1(I/O9)
D10: U9.F4(DQ10) U15.M2(DQ10) U16.C2(I/O10)
D11: U9.G4(DQ11) U15.P1(DQ11) U16.D2(I/O11)
D12: U9.F5(DQ12) U15.N2(DQ12) U16.E2(I/O12)
D13: U9.G6(DQ13) U15.R1(DQ13) U16.F2(I/O13)
D14: U9.F6(DQ14) U15.N3(DQ14) U16.F1(I/O14)
D15: U9.G7(DQ15A-1) U15.R2(DQ15) U16.G1(I/O15)
D16: U15.E8(DQ16)
D17: U15.D7(DQ17)
D18: U15.D8(DQ18)
D19: U15.B9(DQ19)
D20: U15.C8(DQ20)
D21: U15.A9(DQ21)
D22: U15.C7(DQ22)
D23: U15.A8(DQ23)
D24: U15.A2(DQ24)
D25: U15.C3(DQ25)
D26: U15.A1(DQ26)
D27: U15.C2(DQ27)
D28: U15.B1(DQ28)
D29: U15.D2(DQ29)
D30: U15.D3(DQ30)
D31: U15.E2(DQ31)
PD4: U9.G2(~{G}) U16.A2(~{OE}) ; port FMC_NOE
PD5: R99.2 ; port FMC_NWE
PD7: R85.2 ; port FMC_NE1
PE0: U15.K9(DQM0) U16.A1(~{BLE}) ; port FMC_NBL0
PE1: U15.K1(DQM1) U16.B2(~{BHE}) ; port FMC_NBL1
PF11: U15.J9(RAS#) ; port SDNRAS
PG8: U15.J1(CLK) ; port SDCLK
PG9: R135.2 ; port FMC_NE2
PG15: U15.K7(CAS#) ; port SDNCAS
PH2: R285.2 ; port SDCKE0
PH3: U15.J8(CS#) ; port SDNE0
PH5: U15.K8(WE#) ; port SDNWE
PI4: U15.F8(DQM2) ; port FMC_NBL2
PI5: U15.F2(DQM3) ; port FMC_NBL3
NetC41_1: C41.1 R79.2 U9.B5(~{RP})
NetCN11_6: R86.1 U9.A4(R~{B}) ; port FMC_NWAIT
NetJP11_2: JP11.2(NO) R106.1 U9.B4(Vpp/~{WP})
NetR84_1: R84.1 R85.1 U9.F2(~{E})
NetR99_1: R99.1 U9.A5(~{W}) U16.G5(~{WE})
NetR134_1: R134.1 R135.1 U16.B5(~{CE})
NetR282_1: R282.1 U9.F7(~{BYTE})
NetR285_1: R285.1 U15.J2(CKE)

Not connected (* = marked no-connect by the designer): U15 E3(NC) E7(NC) H3(NC) H7(NC) K2(NU) K3(NC)

### Buses and harness runs
bus A[0..23] = port A[0..23]
bus D[0..31] = port D[0..31]

### Notes on the sheet
- PH5
- (near R285) PG15
- (near R135) PG9
- (near R285) PF11
- (near R285) PH3
- (near R285) PH2
- (near R285) PG8
- (near R135) PE1
- (near R135) PE0
- FMC_NBL1
- FMC_NBL0
- (near R285) PI5
- (near R285) PI4
- CY7C1071DV33-12BAXI
- SRAM
- PD5
- PD7
- PD6
- PD4
- (near U9) S29GL128S90FHI02
- (near U9) Nor Flash
- (near JP11) Default setting: Open
- (near U15) MT48LC4M32B2B5-7
- (near U15) SDRAM
- Place close SRAM
- Place close Nor Flash
- Place close SDRAM
- Title:
- Project:
- Size:
- Date:
- A4
- Reference:
- Sheet:
- Revision:
- of

### Library data of the parts
C41 C150 C153 C154 C157-C172 = Cap: Capacitor; Value: 10nF; Published: 8-Jun-2000; Revision: July-2002: Re-released for DXP Platform.; Publisher: Altium Limited
JP11 = JP2
R79 R84-R86 R99 R106 R134 R135 R282 R285 = Res1: Resistor; Value: 1K; Published: 8-Jun-2000; Revision: July-2002: Re-released for DXP Platform.; Publisher: Altium Limited
U9 = M29W128FL70ZA6E
U15 = MT48LC4M32B2B5